# EAGLE schematic Bhoreal Slimpro (EAGLE 7.7.0)

## Sheet 1 of 8
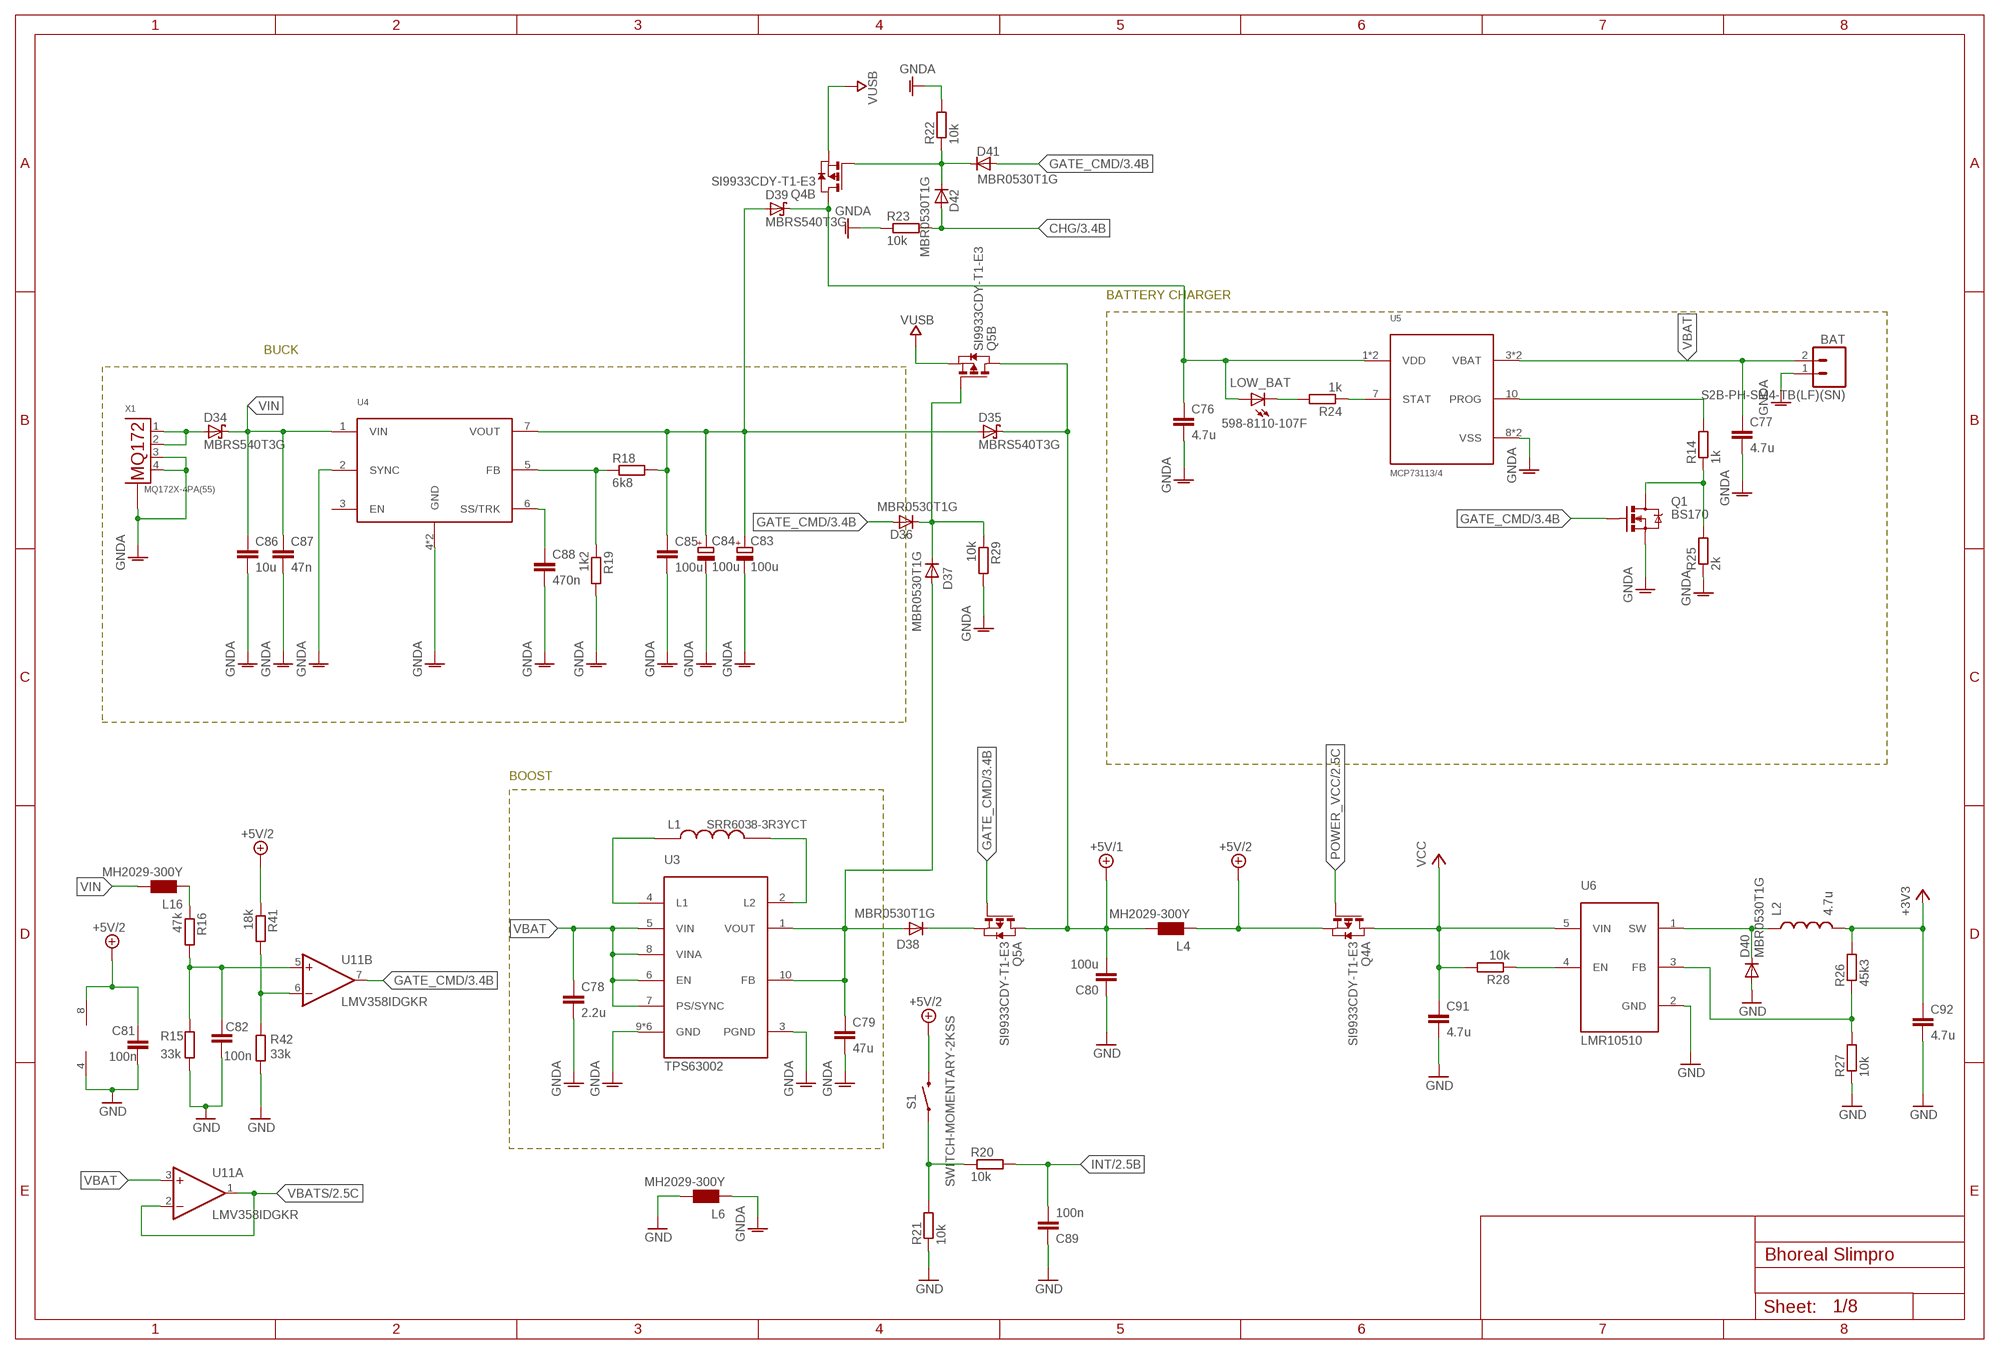
[diagram p0: schematic, sheet 1]

### Parts
BAT  S2B-PH-SM4-TB(LF)(SN)  M02-JST-2MM-SMT  [S2B-PH]
C76  4.7u  C-EUC0805  [C0805]
C77  4.7u  C-EUC0805  [C0805]
C78  2.2u  C-EUC0805  [C0805]
C79  47u  C-EUC1812  [C1812]
C80  100u  C-EUC1206  [C1206]
C81  100n  C-EUC0603  [C0603]
C82  100n  C-EUC0603  [C0603]
C83  100u  CPOL-EUD/7343-31R  [D/7343-31R]
C84  100u  CPOL-EUD/7343-31R  [D/7343-31R]
C85  100u  C-EUC1210  [C1210]
C86  10u  C-EUC1210  [C1210]
C87  47n  C-EUC1206  [C1206]
C88  470n  C-EUC0805  [C0805]
C89  100n  C-EUC0603  [C0603]
C91  4.7u  C-EUC0603  [C0603]
C92  4.7u  C-EUC0603  [C0603]
D34  MBRS540T3G  SCHOTTKY-DIODESMC  [SMC]
D35  MBRS540T3G  SCHOTTKY-DIODESMC  [SMC]
D36  MBR0530T1G  DIODE-SOD123  [SOD123]
D37  MBR0530T1G  DIODE-SOD123  [SOD123]
D38  MBR0530T1G  DIODE-SOD123  [SOD123]
D39  MBRS540T3G  SCHOTTKY-DIODESMC  [SMC]
D40  MBR0530T1G  DIODE-SOD123  [SOD123]
D41  MBR0530T1G  DIODE-SOD123  [SOD123]
D42  MBR0530T1G  DIODE-SOD123  [SOD123]
L1  SRR6038-3R3YCT  LSRR6038  [SRR6038]
L2  4.7u  INDUCTOR1210  [1210]
L4  MH2029-300Y  WE-CBF_0805  [0805]
L6  MH2029-300Y  WE-CBF_0805  [0805]
L16  MH2029-300Y  WE-CBF_0805  [0805]
LOW_BAT  598-8110-107F  LEDCHIP-LED0805  [CHIP-LED0805]
Q1  BS170  MOSFET-NCHANNELBSS123LT1G  [SOT23]
Q4  SI9933CDY-T1-E3  PMOS2SO8  [SO8]
Q5  SI9933CDY-T1-E3  PMOS2SO8  [SO8]
R14  1k  R-EU_R0603  [R0603]
R15  33k  R-EU_R0603  [R0603]
R16  47k  R-EU_R0603  [R0603]
R18  6k8  R-EU_R0603  [R0603]
R19  1k2  R-EU_R0603  [R0603]
R20  10k  R-EU_R0603  [R0603]
R21  10k  R-EU_R0603  [R0603]
R22  10k  R-EU_R0603  [R0603]
R23  10k  R-EU_R0603  [R0603]
R24  1k  R-EU_R0603  [R0603]
R25  2k  R-EU_R0603  [R0603]
R26  45k3  R-EU_R0603  [R0603]
R27  10k  R-EU_R0603  [R0603]
R28  10k  R-EU_R0603  [R0603]
R29  10k  R-EU_R0603  [R0603]
R41  18k  R-EU_R0603  [R0603]
R42  33k  R-EU_R0603  [R0603]
S1  SWITCH-MOMENTARY-2KSS  [KSS241G]
U3  TPS63002  [QFN-10_PAD]
U4  LMZ2200X  [TO-PMOD]
U5  MCP73113/4  [DFN-10]
U6  LMR10510  LMR10510SOT23  [SOT23-5L]
U11  LMV358IDGKR  LMV358MMX  [MSOP08]
X1  MQ172X-4PA(55)  [MQ172X-4PA(55)]

### Nets
+3V3: C92.1 L2.2 R26.2 ; also sheet 3,4
+5V/1 [power]: C80.2 D35.C L4.2 Q5.5(B:D) Q5.6(B:D) Q5.7(A:D) Q5.8(A:D) ; also sheet 4
+5V/2: C81.1 L4.1 Q4.1(A:S) R41.1 S1.2 U11.8(P:V+) ; also sheet 2,3
CHG: D42.A R23.2 ; also sheet 3
CMP: C82.2 R15.1 R16.2 U11.5(B:+IN)
GATE_CMD: D36.A D41.A Q1.1(G) Q5.2(A:G) U11.7(B:OUT) ; also sheet 3
GND: C80.1 C81.2 C82.1 C89.1 C91.2 C92.2 D40.A L6.2 R15.2 R21.1 R27.1 R42.2 U6.2(GND) U11.4(P:V-) ; also sheet 2,3,4
GNDA [power]: BAT.1 C76.2 C77.2 C78.2 C79.2 C83.- C84.- C85.2 C86.2 C87.2 C88.2 L6.1 Q1.2(S) R19.2 R22.2 R23.1 R25.1 R29.2 U3.3(PGND) U3.9(GND) U3.11(GND) U3.12(GND) U3.13(GND) U3.14(GND) U3.15(GND) U4.2(SYNC) U4.4(GND) U4.8(GND) U5.8(VSS) U5.9(VSS) X1.3 X1.4 X1.P$1 X1.P$2 ; also sheet 2,5,6,7,8
INT: C89.2 R20.2 ; also sheet 2,3
N$61: R41.2 R42.1 U11.6(B:-IN)
N$120: D41.C D42.C Q4.4(B:G) R22.1
N$121: R14.2 U5.10(PROG)
N$122: L1.P$1 U3.4(L1)
N$123: L1.P$2 U3.2(L2)
N$124: D34.A X1.1 X1.2
N$125 [power]: C79.1 D37.A D38.A U3.1(VOUT) U3.10(FB)
N$126 [power]: C76.1 D39.C LOW_BAT.A Q4.5(B:D) Q4.6(B:D) U5.1(VDD) U5.2(VDD)
N$127: C83.+ C84.+ C85.1 D35.A D39.A R18.2 U4.7(VOUT)
N$129: R18.1 R19.1 U4.5(FB)
N$130: C88.1 U4.6(SS/TRK)
N$131: R20.1 R21.2 S1.1
N$132: D36.C D37.C Q5.4(B:G) R29.1
N$133: LOW_BAT.C R24.2
N$134: R24.1 U5.7(STAT)
N$135: Q1.3(D) R14.1 R25.2
N$136: D40.C L2.1 U6.1(SW)
N$137: R28.1 U6.4(EN)
N$138: R26.1 R27.2 U6.3(FB)
N$139: D38.C Q5.1(A:S)
N$146: L16.1 R16.1
POWER_VCC: Q4.2(A:G) ; also sheet 2
VBAT [power]: BAT.2 C77.1 C78.1 U3.5(VIN) U3.6(EN) U3.7(PS/SYNC) U3.8(VINA) U5.3(VBAT) U5.4(VBAT) U11.3(A:+IN)
VBATS: U11.1(A:OUT) U11.2(A:-IN) ; also sheet 2,3
VCC: C91.1 Q4.7(A:D) Q4.8(A:D) R28.2 U6.5(VIN) ; also sheet 4,5,6,7,8
VIN: C86.1 C87.1 D34.C L16.2 U4.1(VIN)
VUSB [power]: Q4.3(B:S) Q5.3(B:S) ; also sheet 2,3
Unconnected: U4.3(EN)

### Notes on the sheet
- BATTERY CHARGER
- BUCK
- BOOST

## Sheet 2 of 8
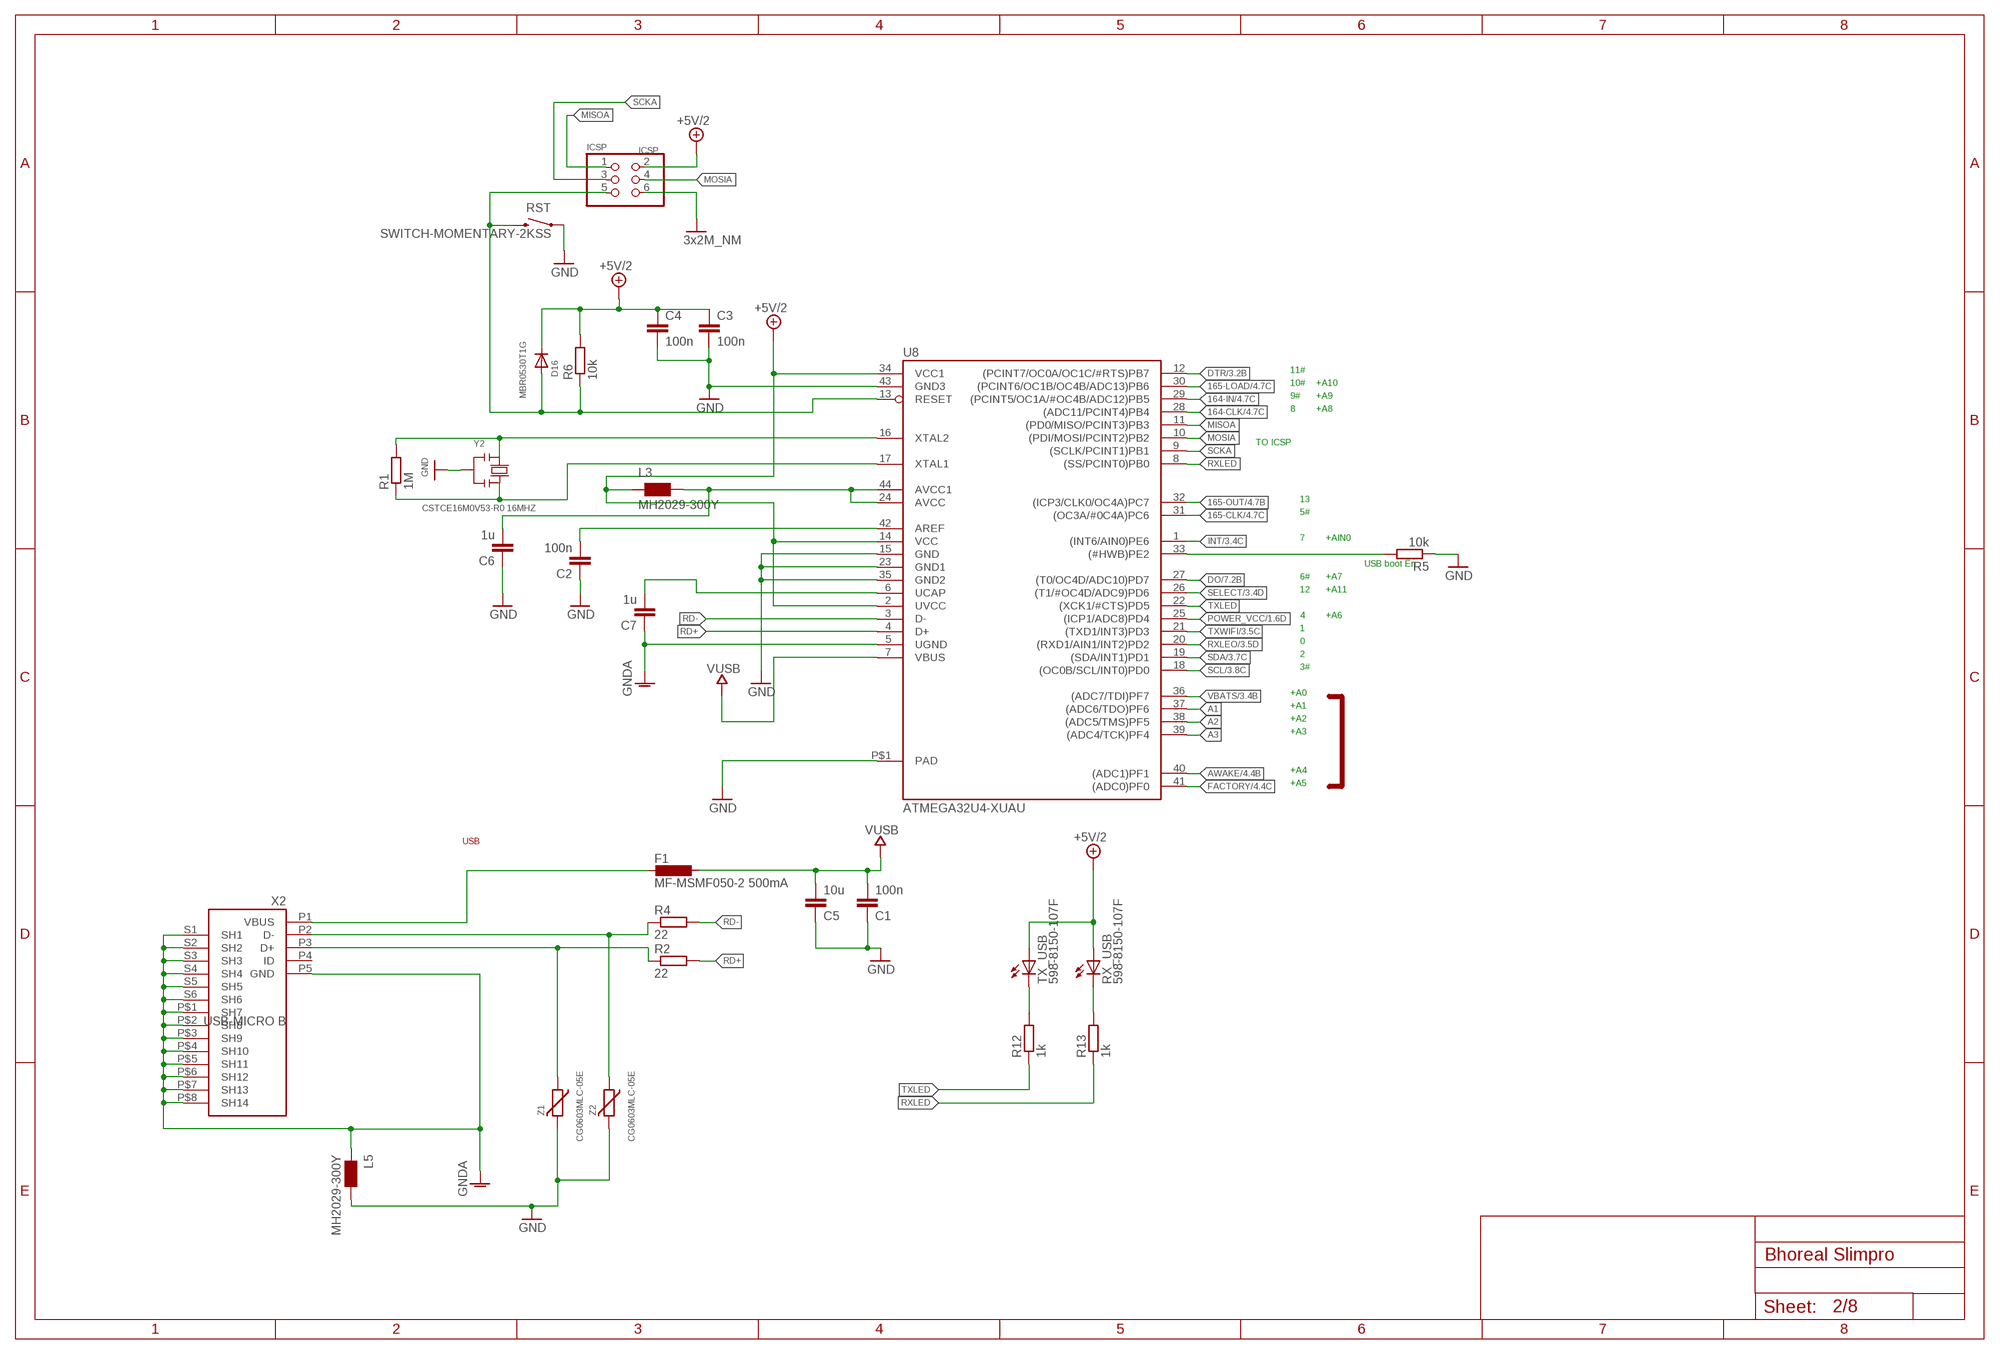
[diagram p1: schematic, sheet 2]

### Parts
C1  100n  C-EUC0603  [C0603]
C2  100n  C-EUC0603  [C0603]
C3  100n  C-EUC0603  [C0603]
C4  100n  C-EUC0603  [C0603]
C5  10u  C-EUC0805  [C0805]
C6  1u  C-EUC0805  [C0805]
C7  1u  C-EUC0805  [C0805]
D16  MBR0530T1G  DIODE-SOD123  [SOD123]
F1  MF-MSMF050-2 500mA  L-EUL1812  [L1812]
ICSP  ICSP  PINHD-2X3  [2X03]
L3  MH2029-300Y  WE-CBF_0805  [0805]
L5  MH2029-300Y  WE-CBF_0805  [0805]
R1  1M  R-EU_R0603  [R0603]
R2  22  R-EU_R0603  [R0603]
R4  22  R-EU_R0603  [R0603]
R5  10k  R-EU_R0603  [R0603]
R6  10k  R-EU_R0603  [R0603]
R12  1k  R-EU_R0603  [R0603]
R13  1k  R-EU_R0603  [R0603]
RST  SWITCH-MOMENTARY-2KSS  [KSS241G]
RX_USB  598-8150-107F  LEDCHIPLED_0805  [CHIPLED_0805]
TX_USB  598-8150-107F  LEDCHIPLED_0805  [CHIPLED_0805]
U8  ATMEGA32U4-XUAU  [TQFP44-PAD]
X2  USB-MICRO B  MYCON2_USB-MINI-B  [CON2_USB_MICRO_B_AT]
Y2  CSTCE16M0V53-R0 16MHZ  RESONATORMU  [RESONATOR]
Z1  CG0603MLC-05E  VARISTORCN0603  [CT/CN0603]
Z2  CG0603MLC-05E  VARISTORCN0603  [CT/CN0603]

### Nets
164-CLK: U8.28((ADC11/PCINT4)PB4) ; also sheet 4
164-IN: U8.29((PCINT5/OC1A/#OC4B/ADC12)PB5) ; also sheet 4
165-CLK: U8.31((OC3A/#0C4A)PC6) ; also sheet 4
165-LOAD: U8.30((PCINT6/OC1B/OC4B/ADC13)PB6) ; also sheet 4
165-OUT: U8.32((ICP3/CLK0/OC4A)PC7) ; also sheet 4
+5V/2: C3.1 C4.1 D16.C ICSP.2 L3.1 R6.2 RX_USB.A TX_USB.A U8.2(UVCC) U8.14(VCC) U8.34(VCC1) ; also sheet 1,3
A1: U8.37((ADC6/TDO)PF6)
A2: U8.38((ADC5/TMS)PF5)
A3: U8.39((ADC4/TCK)PF4)
AREF: C2.2 U8.42(AREF)
AVCC: C6.2 L3.2 U8.24(AVCC) U8.44(AVCC1)
AWAKE: U8.40((ADC1)PF1) ; also sheet 4
D+: R2.1 X2.P3(D+) Z1.1
D-: R4.1 X2.P2(D-) Z2.1
DO: U8.27((T0/OC4D/ADC10)PD7) ; also sheet 7
DTR: U8.12((PCINT7/OC0A/OC1C/#RTS)PB7) ; also sheet 3
FACTORY: U8.41((ADC0)PF0) ; also sheet 4
GND: C1.1 C2.1 C3.2 C4.2 C5.1 C6.1 ICSP.6 L5.2 R5.1 RST.1 U8.15(GND) U8.23(GND1) U8.35(GND2) U8.43(GND3) U8.P$1(PAD) Y2.2 Z1.2 Z2.2 ; supply symbol labelled 3x2M_NM ; also sheet 1,3,4
GNDA [power]: C7.1 L5.1 U8.5(UGND) X2.P5(GND) X2.P$1(SH7) X2.P$2(SH8) X2.P$3(SH9) X2.P$4(SH10) X2.P$5(SH11) X2.P$6(SH12) X2.P$7(SH13) X2.P$8(SH14) X2.S1(SH1) X2.S2(SH2) X2.S3(SH3) X2.S4(SH4) X2.S5(SH5) X2.S6(SH6) ; also sheet 1,5,6,7,8
HWB: R5.2 U8.33((#HWB)PE2)
INT: U8.1((INT6/AIN0)PE6) ; also sheet 1,3
MISOA: ICSP.1 U8.11((PD0/MISO/PCINT3)PB3)
MOSIA: ICSP.4 U8.10((PDI/MOSI/PCINT2)PB2)
N$2 [usbvcc]: R12.2 TX_USB.C
N$4 [usbvcc]: R13.2 RX_USB.C
POWER_VCC: U8.25((ICP1/ADC8)PD4) ; also sheet 1
RD+: R2.2 U8.4(D+)
RD-: R4.2 U8.3(D-)
RST: D16.A ICSP.5 R6.1 RST.2 U8.13(RESET) ; also sheet 4
RXLED: R13.1 U8.8((SS/PCINT0)PB0)
RXLEO: U8.20((RXD1/AIN1/INT2)PD2) ; also sheet 3
SCKA: ICSP.3 U8.9((SCLK/PCINT1)PB1)
SCL: U8.18((OC0B/SCL/INT0)PD0) ; also sheet 3
SDA: U8.19((SDA/INT1)PD1) ; also sheet 3
SELECT: U8.26((T1/#OC4D/ADC9)PD6) ; also sheet 3
TXLED: R12.1 U8.22((XCK1/#CTS)PD5)
TXWIFI: U8.21((TXD1/INT3)PD3) ; also sheet 3,4
UCAP: C7.2 U8.6(UCAP)
VBATS: U8.36((ADC7/TDI)PF7) ; also sheet 1,3
VUSB [power]: C1.2 C5.2 F1.1 U8.7(VBUS) ; also sheet 1,3
XTAL3: R1.2 U8.16(XTAL2) Y2.1
XTAL4: R1.1 U8.17(XTAL1) Y2.3
XUSB [power]: F1.2 X2.P1(VBUS)
Unconnected: X2.P4(ID)

### Notes on the sheet
- 11#
- 10# | +A10
- 9# | +A9
- 8 | +A8
- TO ICSP
- 13
- 5#
- 7 | +AIN0
- USB boot En
- 6# | +A7
- 12 | +A11
- 4 | +A6
- 1
- 0
- 2
- 3#
- +A0
- +A1
- +A2
- +A3
- +A4
- +A5
- USB

## Sheet 3 of 8
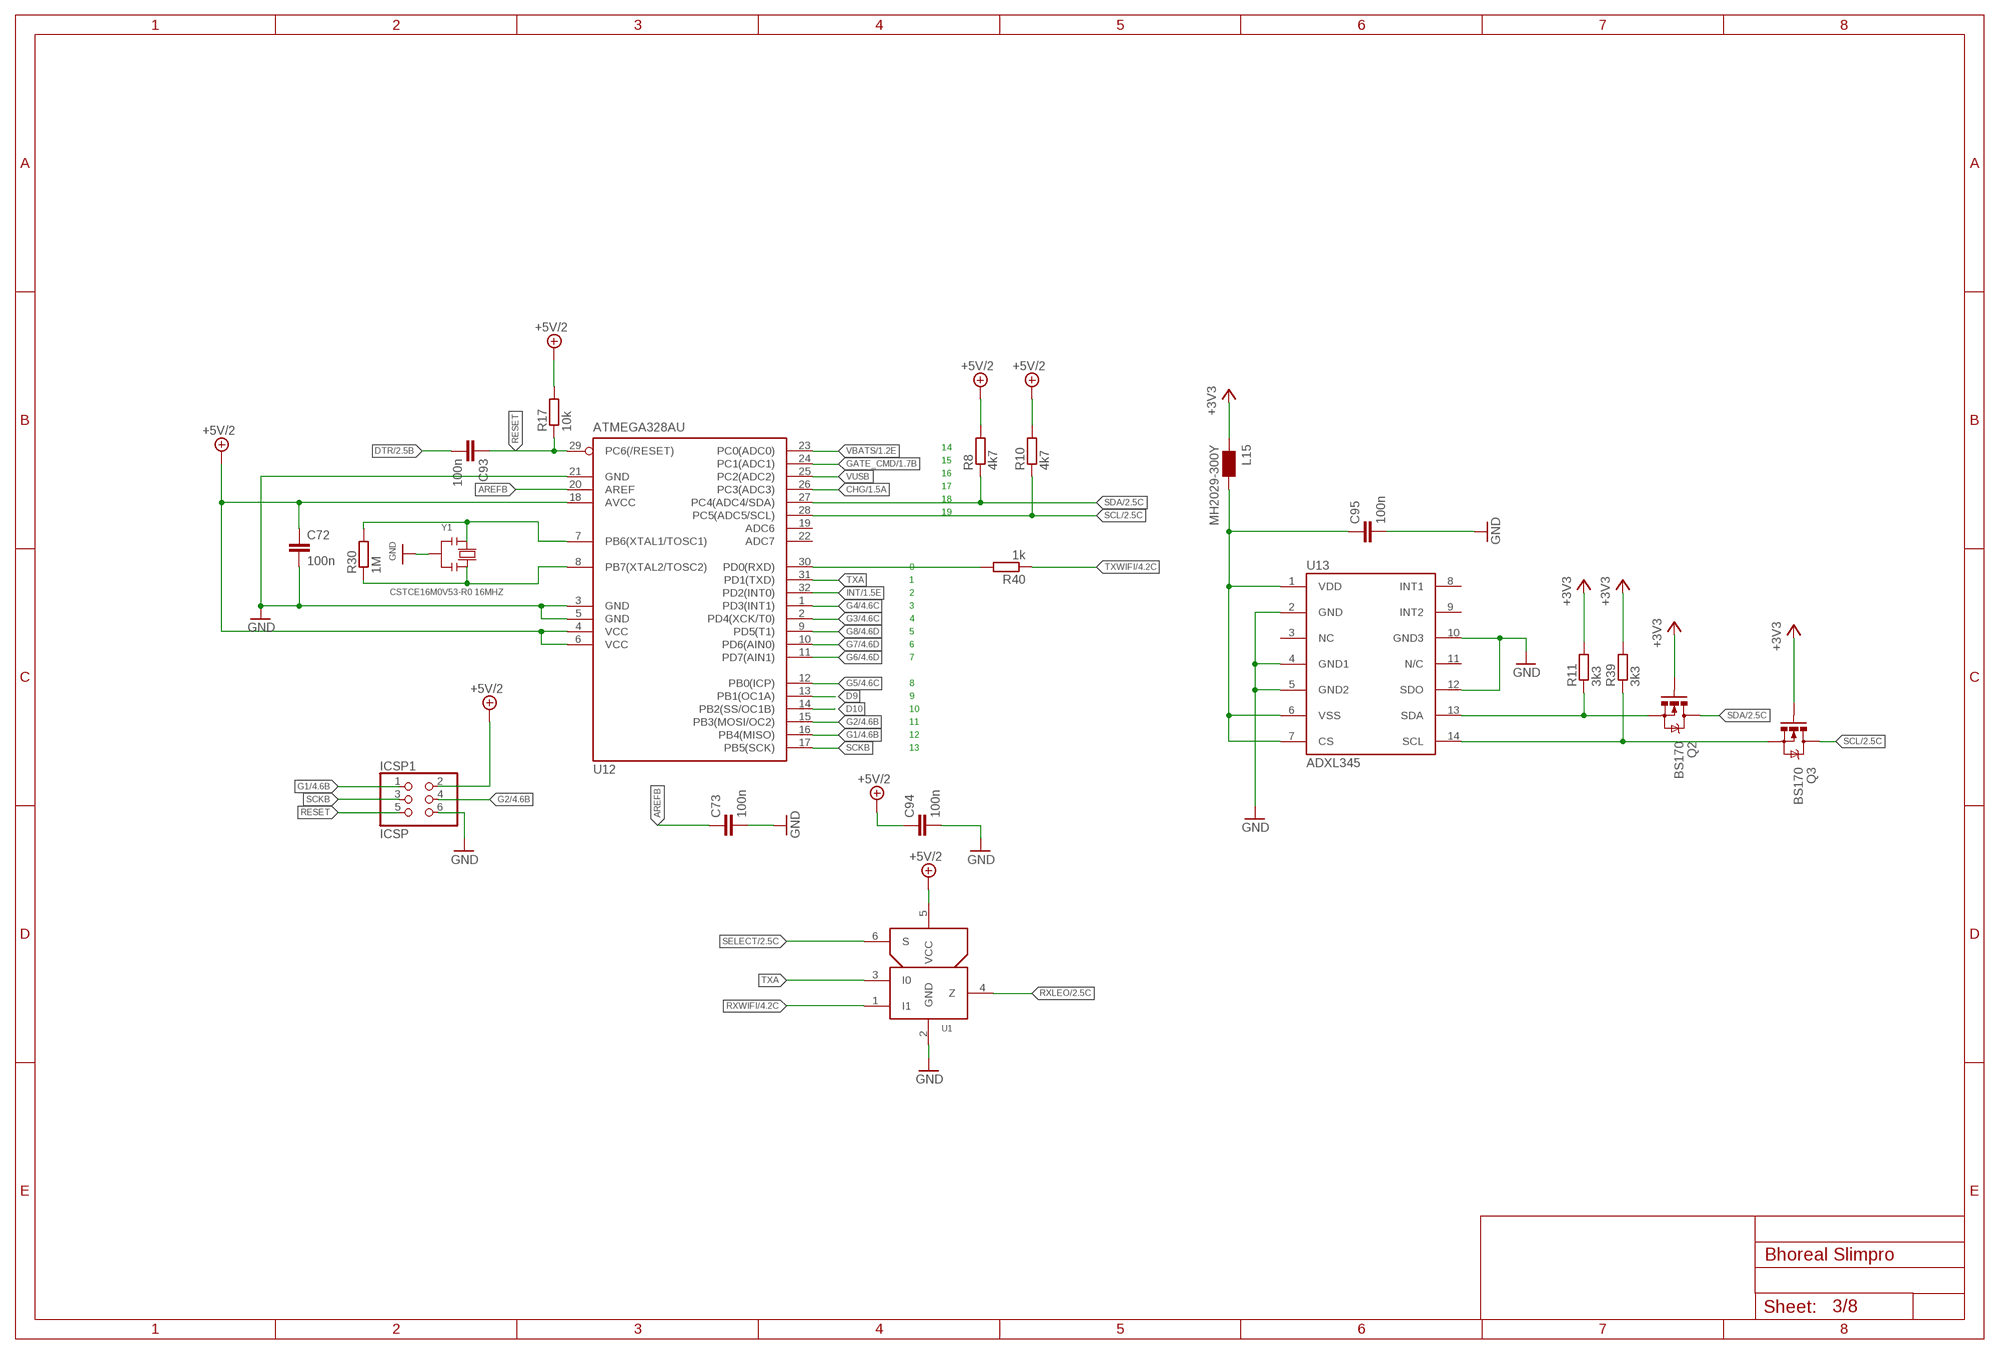
[diagram p2: schematic, sheet 3]

### Parts
C72  100n  C-EUC0603  [C0603]
C73  100n  C-EUC0603  [C0603]
C93  100n  C-EUC0603  [C0603]
C94  100n  C-EUC0603  [C0603]
C95  100n  C-EUC0603  [C0603]
ICSP1  ICSP  PINHD-2X3  [2X03]
L15  MH2029-300Y  WE-CBF_0805  [0805]
Q2  BS170  MOSFET-NCHANNELBSS123LT1G  [SOT23]
Q3  BS170  MOSFET-NCHANNELBSS123LT1G  [SOT23]
R8  4k7  R-EU_R0603  [R0603]
R10  4k7  R-EU_R0603  [R0603]
R11  3k3  R-EU_R0603  [R0603]
R17  10k  R-EU_R0603  [R0603]
R30  1M  R-EU_R0603  [R0603]
R39  3k3  R-EU_R0603  [R0603]
R40  1k  R-EU_R0603  [R0603]
U1  NC7SZ157P6X  NC7SV157  [SC70]
U12  ATMEGA328AU  MEGA8-AI  [TQFP32-08]
U13  ADXL345  [LGA14]
Y1  CSTCE16M0V53-R0 16MHZ  RESONATORMU  [RESONATOR]

### Nets
+3V3: L15.1 Q2.1(G) Q3.1(G) R11.2 R39.2 ; also sheet 1,4
+5V/2: C72.1 C94.1 ICSP1.2 R8.2 R10.2 R17.2 U1.5(VCC) U12.4(VCC) U12.6(VCC) U12.18(AVCC) ; also sheet 1,2
AREFB: C73.1 U12.20(AREF)
CHG: U12.26(PC3(ADC3)) ; also sheet 1
D9: U12.13(PB1(OC1A))
D10: U12.14(PB2(SS/OC1B))
DTR: C93.2 ; also sheet 2
G1: ICSP1.1 U12.16(PB4(MISO)) ; also sheet 4
G2: ICSP1.4 U12.15(PB3(MOSI/OC2)) ; also sheet 4
G3: U12.2(PD4(XCK/T0)) ; also sheet 4
G4: U12.1(PD3(INT1)) ; also sheet 4
G5: U12.12(PB0(ICP)) ; also sheet 4
G6: U12.11(PD7(AIN1)) ; also sheet 4
G7: U12.10(PD6(AIN0)) ; also sheet 4
G8: U12.9(PD5(T1)) ; also sheet 4
GATE_CMD: U12.24(PC1(ADC1)) ; also sheet 1
GND: C72.2 C73.2 C94.2 C95.2 ICSP1.6 U1.2(GND) U12.3(GND) U12.5(GND) U12.21(GND) U13.2(GND) U13.4(GND1) U13.5(GND2) U13.10(GND3) U13.12(SDO) Y1.2 ; also sheet 1,2,4
INT: U12.32(PD2(INT0)) ; also sheet 1,2
N$128: C95.1 L15.2 U13.1(VDD) U13.6(VSS) U13.7(CS)
N$143: Q2.2(S) R11.1 U13.13(SDA)
N$144: Q3.2(S) R39.1 U13.14(SCL)
RESET: C93.1 ICSP1.5 R17.1 U12.29(PC6(/RESET))
RXA: R40.2 U12.30(PD0(RXD))
RXLEO: U1.4(Z) ; also sheet 2
RXWIFI: U1.1(I1) ; also sheet 4
SCKB: ICSP1.3 U12.17(PB5(SCK))
SCL: Q3.3(D) R10.1 U12.28(PC5(ADC5/SCL)) ; also sheet 2
SDA: Q2.3(D) R8.1 U12.27(PC4(ADC4/SDA)) ; also sheet 2
SELECT: U1.6(S) ; also sheet 2
TXA: U1.3(I0) U12.31(PD1(TXD))
TXWIFI: R40.1 ; also sheet 2,4
VBATS: U12.23(PC0(ADC0)) ; also sheet 1,2
VUSB [power]: U12.25(PC2(ADC2)) ; also sheet 1,2
XTAL1: R30.2 U12.7(PB6(XTAL1/TOSC1)) Y1.1
XTAL2: R30.1 U12.8(PB7(XTAL2/TOSC2)) Y1.3
Unconnected: U12.19(ADC6) U12.22(ADC7) U13.3(NC) U13.8(INT1) U13.9(INT2) U13.11(N/C)

### Notes on the sheet
- 14
- 15
- 16
- 17
- 18
- 19
- 0
- 1
- 2
- 3
- 4
- 5
- 6
- 7
- 8
- 9
- 10
- 11
- 12
- 13

## Sheet 4 of 8
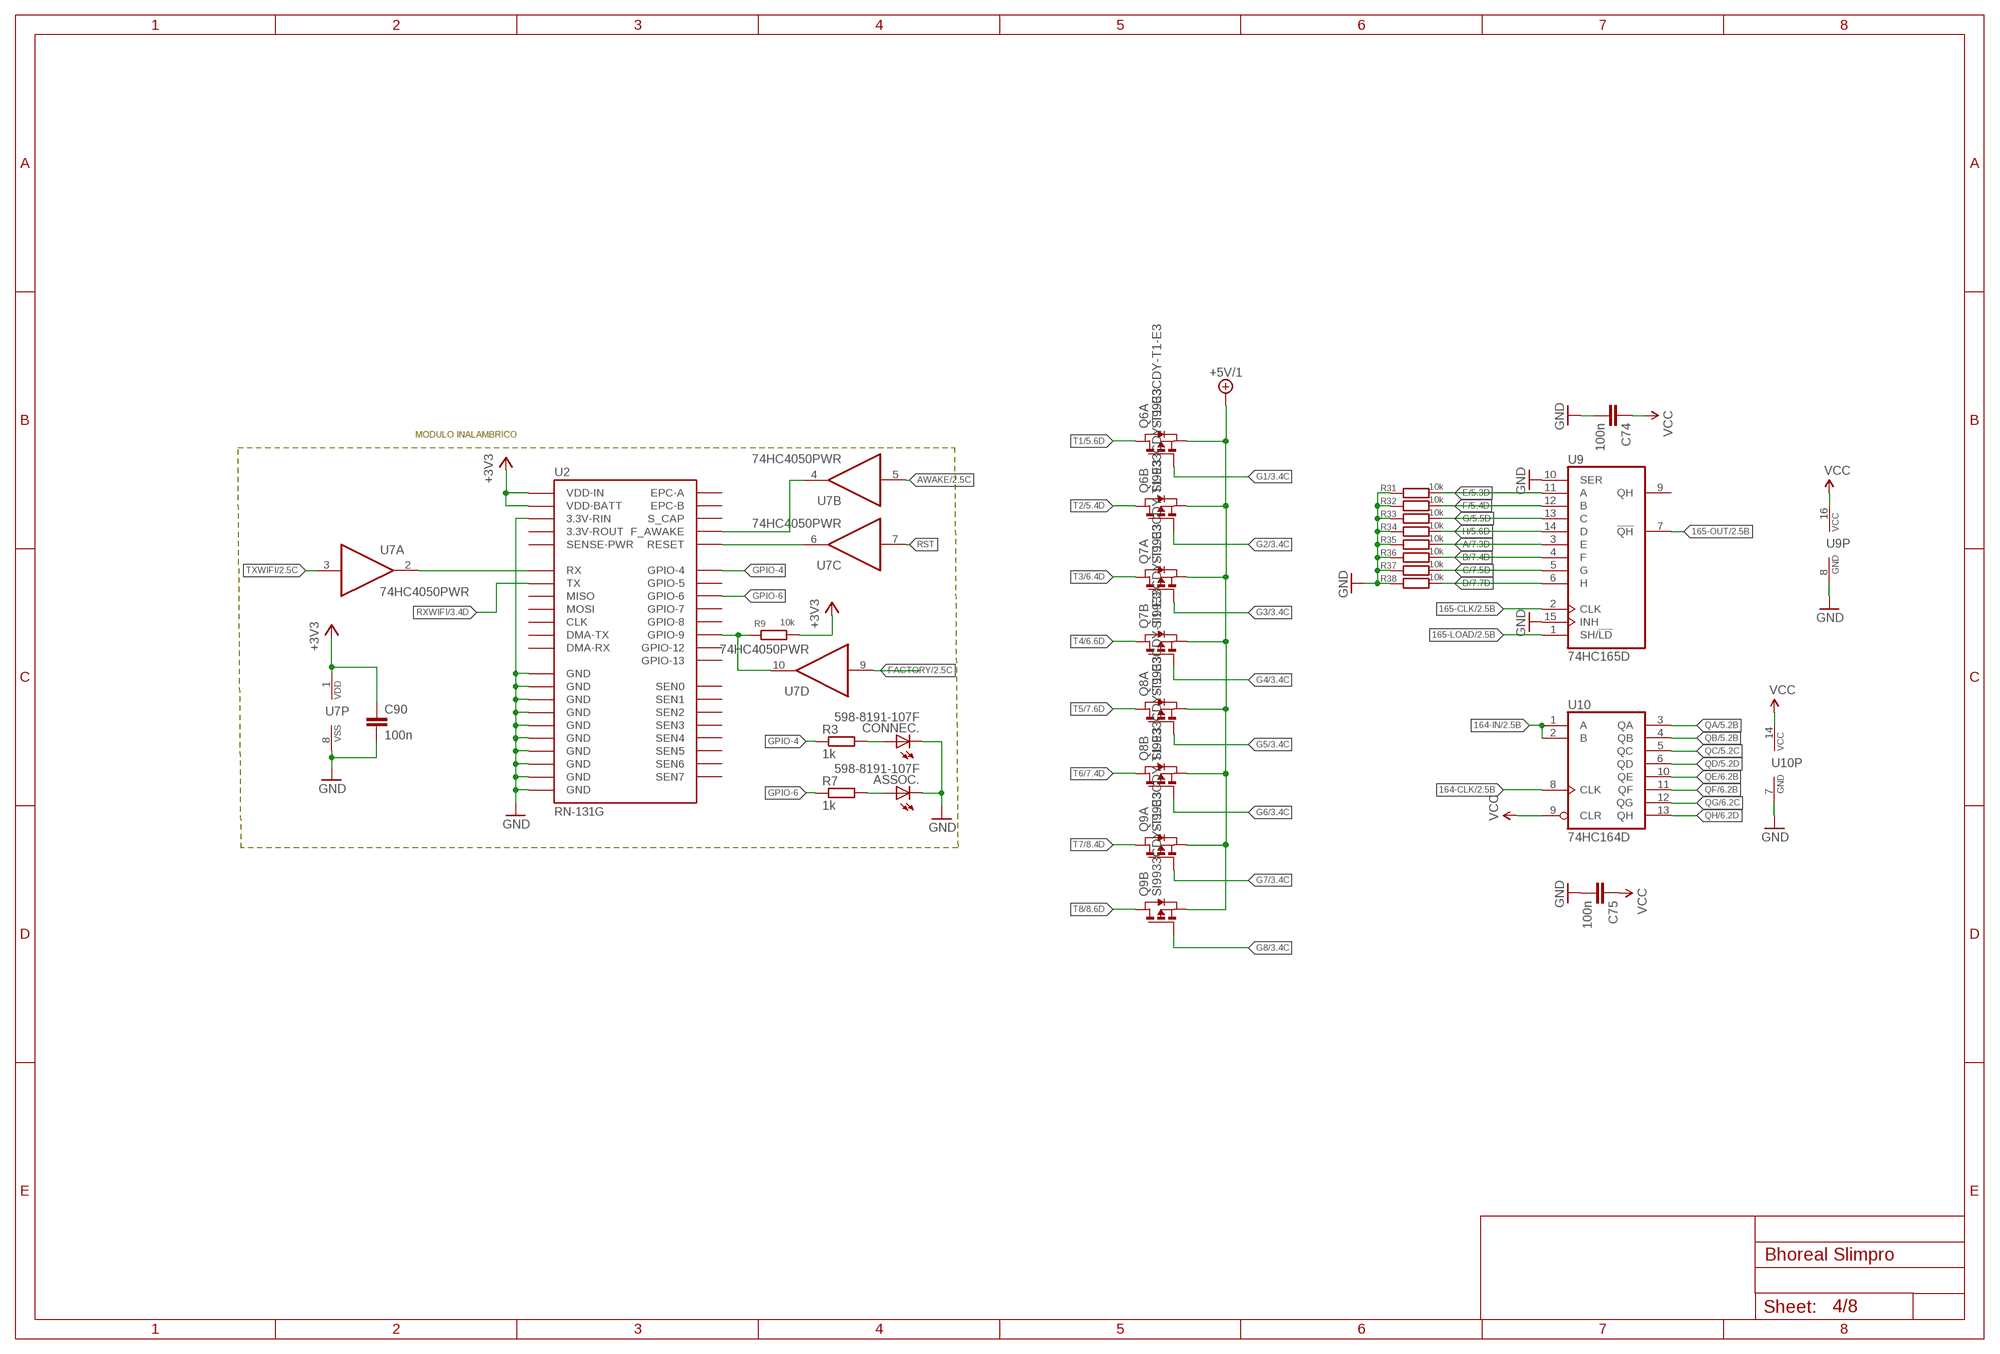
[diagram p3: schematic, sheet 4]

### Parts
ASSOC.  598-8191-107F  LEDCHIP-LED0805  [CHIP-LED0805]
C74  100n  C-EUC0603  [C0603]
C75  100n  C-EUC0603  [C0603]
C90  100n  C-EUC0603  [C0603]
CONNEC.  598-8191-107F  LEDCHIP-LED0805  [CHIP-LED0805]
Q6  SI9933CDY-T1-E3  PMOS2SO8  [SO8]
Q7  SI9933CDY-T1-E3  PMOS2SO8  [SO8]
Q8  SI9933CDY-T1-E3  PMOS2SO8  [SO8]
Q9  SI9933CDY-T1-E3  PMOS2SO8  [SO8]
R3  1k  R-EU_R0603  [R0603]
R7  1k  R-EU_R0603  [R0603]
R9  10k  R-EU_R0603  [R0603]
R31  10k  R-EU_R0603  [R0603]
R32  10k  R-EU_R0603  [R0603]
R33  10k  R-EU_R0603  [R0603]
R34  10k  R-EU_R0603  [R0603]
R35  10k  R-EU_R0603  [R0603]
R36  10k  R-EU_R0603  [R0603]
R37  10k  R-EU_R0603  [R0603]
R38  10k  R-EU_R0603  [R0603]
U2  RN-131G  [RN-131G]
U7  74HC4050PWR  [TSSOP16]
U9  74HC165D  [SO16]
U10  74HC164D  [SO14]

### Nets
164-CLK: U10.8(CLK) ; also sheet 2
164-IN: U10.1(A) U10.2(B) ; also sheet 2
165-CLK: U9.2(CLK) ; also sheet 2
165-LOAD: U9.1(SH/!LD) ; also sheet 2
165-OUT: U9.7(!QH) ; also sheet 2
+3V3: C90.1 R9.2 U2.P$20(VDD-BATT) U2.P$21(VDD-IN) U7.1(P:VDD) ; also sheet 1,3
+5V/1 [power]: Q6.1(A:S) Q6.3(B:S) Q7.1(A:S) Q7.3(B:S) Q8.1(A:S) Q8.3(B:S) Q9.1(A:S) Q9.3(B:S) ; also sheet 1
A: R35.2 U9.3(E) ; also sheet 7,8
AWAKE: U7.5(B:I) ; also sheet 2
B: R36.2 U9.4(F) ; also sheet 7,8
C: R37.2 U9.5(G) ; also sheet 7,8
D: R38.2 U9.6(H) ; also sheet 7,8
E: R31.2 U9.11(A) ; also sheet 5,6
F: R32.2 U9.12(B) ; also sheet 5,6
FACTORY: U7.9(D:I) ; also sheet 2
G: R33.2 U9.13(C) ; also sheet 5,6
G1: Q6.2(A:G) ; also sheet 3
G2: Q6.4(B:G) ; also sheet 3
G3: Q7.2(A:G) ; also sheet 3
G4: Q7.4(B:G) ; also sheet 3
G5: Q8.2(A:G) ; also sheet 3
G6: Q8.4(B:G) ; also sheet 3
G7: Q9.2(A:G) ; also sheet 3
G8: Q9.4(B:G) ; also sheet 3
GND: ASSOC..C C74.2 C75.2 C90.2 CONNEC..C R31.1 R32.1 R33.1 R34.1 R35.1 R36.1 R37.1 R38.1 U2.P$18(3.3V-RIN) U2.P$19(GND) U2.P$36(GND) U2.P$37(GND) U2.P$38(GND) U2.P$39(GND) U2.P$40(GND) U2.P$41(GND) U2.P$42(GND) U2.P$43(GND) U2.P$44(GND) U7.8(P:VSS) U9.8(GND) U9.10(SER) U9.15(INH) U10.7(GND) ; also sheet 1,2,3
GPIO-4: R3.1 U2.P$29(GPIO-4)
GPIO-6: R7.1 U2.P$27(GPIO-6)
H: R34.2 U9.14(D) ; also sheet 5,6
N$117: CONNEC..A R3.2
N$118: ASSOC..A R7.2
N$119: U2.P$12(RX) U7.2(A:O)
N$140: R9.1 U2.P$24(GPIO-9) U7.10(D:O)
N$141: U2.P$9(F_AWAKE) U7.4(B:O)
N$142: U2.P$5(RESET) U7.6(C:O)
QA: U10.3(QA) ; also sheet 5,7
QB: U10.4(QB) ; also sheet 5,7
QC: U10.5(QC) ; also sheet 5,7
QD: U10.6(QD) ; also sheet 5,7
QE: U10.10(QE) ; also sheet 6,8
QF: U10.11(QF) ; also sheet 6,8
QG: U10.12(QG) ; also sheet 6,8
QH: U10.13(QH) ; also sheet 6,8
RST: U7.7(C:I) ; also sheet 2
RXWIFI: U2.P$13(TX) ; also sheet 3
T1 [power_led]: Q6.7(A:D) Q6.8(A:D) ; also sheet 5
T2 [power_led]: Q6.5(B:D) Q6.6(B:D) ; also sheet 5
T3 [power_led]: Q7.7(A:D) Q7.8(A:D) ; also sheet 6
T4 [power_led]: Q7.5(B:D) Q7.6(B:D) ; also sheet 6
T5 [power_led]: Q8.7(A:D) Q8.8(A:D) ; also sheet 7
T6 [power_led]: Q8.5(B:D) Q8.6(B:D) ; also sheet 7
T7 [power_led]: Q9.7(A:D) Q9.8(A:D) ; also sheet 8
T8 [power_led]: Q9.5(B:D) Q9.6(B:D) ; also sheet 8
TXWIFI: U7.3(A:I) ; also sheet 2,3
VCC: C74.1 C75.1 U9.16(VCC) U10.9(CLR) U10.14(VCC) ; also sheet 1,5,6,7,8
Unconnected: U2.P$1(SEN6) U2.P$2(SEN4) U2.P$3(SEN5) U2.P$4(SEN7) U2.P$6(EPC-A) U2.P$7(EPC-B) U2.P$8(S_CAP) U2.P$10(GPIO-13) U2.P$11(GPIO-12) U2.P$14(MOSI) U2.P$15(CLK) U2.P$16(MISO) U2.P$17(3.3V-ROUT) U2.P$22(DMA-TX) U2.P$23(DMA-RX) U2.P$25(GPIO-8) U2.P$26(GPIO-7) U2.P$28(GPIO-5) U2.P$30(SEN1) U2.P$31(SEN2) U2.P$32(SEN3) U2.P$33(SENSE-PWR) U2.P$34(SEN0) U7.11(E:I) U7.12(E:O) U7.14(F:I) U7.15(F:O) U9.9(QH)

### Notes on the sheet
- MODULO INALAMBRICO

## Sheet 5 of 8
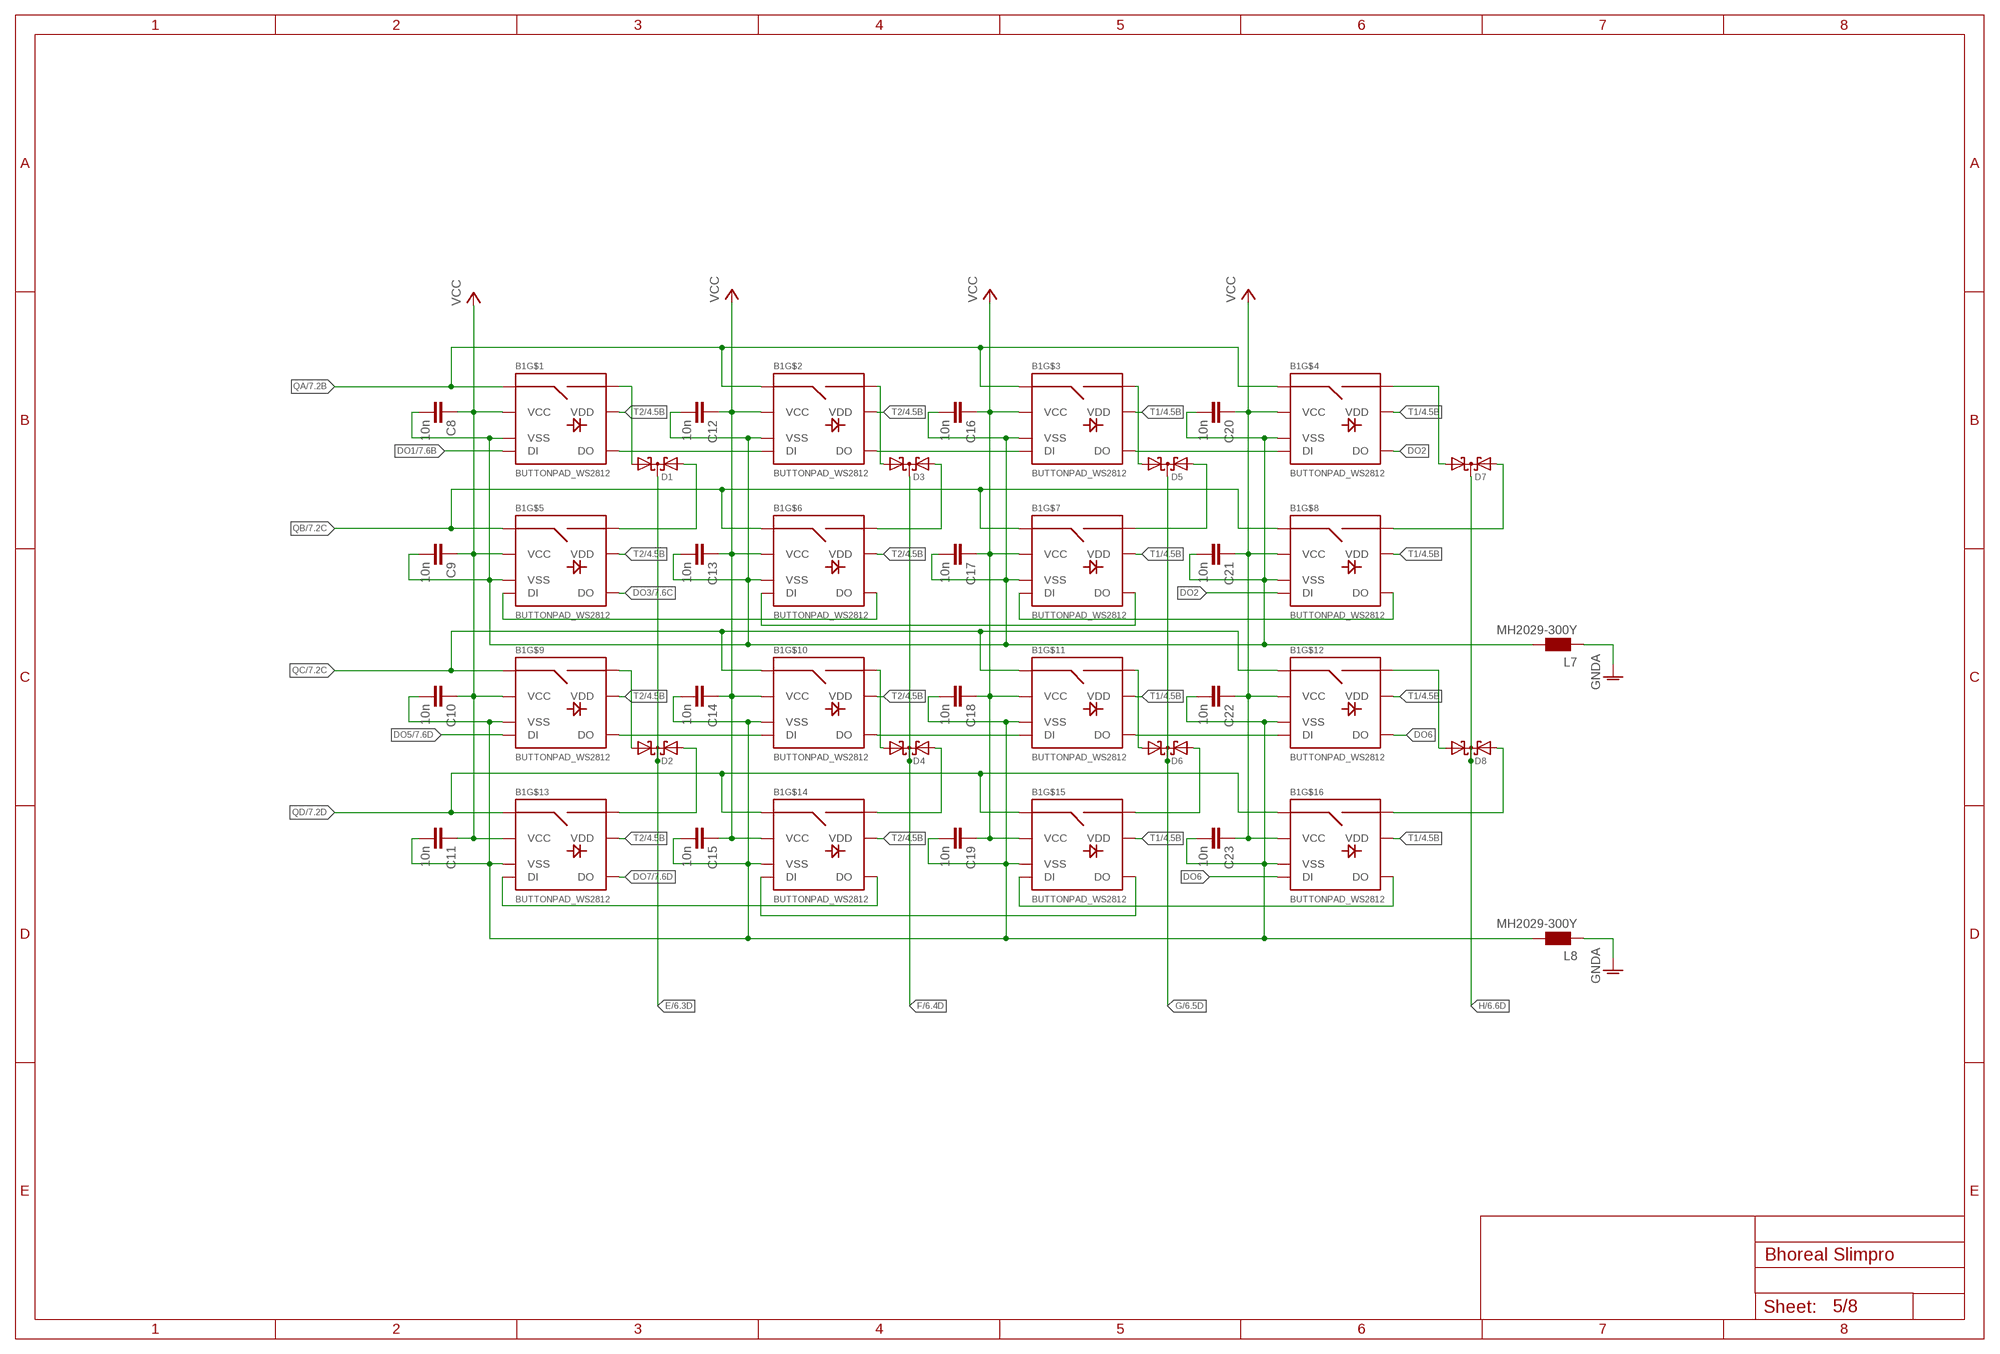
[diagram p4: schematic, sheet 5]

### Parts
B1  BUTTONPAD_WS2812  [BUTTONPAD_WS2812]
C8  10n  C-EUC0603  [C0603]
C9  10n  C-EUC0603  [C0603]
C10  10n  C-EUC0603  [C0603]
C11  10n  C-EUC0603  [C0603]
C12  10n  C-EUC0603  [C0603]
C13  10n  C-EUC0603  [C0603]
C14  10n  C-EUC0603  [C0603]
C15  10n  C-EUC0603  [C0603]
C16  10n  C-EUC0603  [C0603]
C17  10n  C-EUC0603  [C0603]
C18  10n  C-EUC0603  [C0603]
C19  10n  C-EUC0603  [C0603]
C20  10n  C-EUC0603  [C0603]
C21  10n  C-EUC0603  [C0603]
C22  10n  C-EUC0603  [C0603]
C23  10n  C-EUC0603  [C0603]
D1  BAV70LT3G  BAS70-05  [SOT23]
D2  BAV70LT3G  BAS70-05  [SOT23]
D3  BAV70LT3G  BAS70-05  [SOT23]
D4  BAV70LT3G  BAS70-05  [SOT23]
D5  BAV70LT3G  BAS70-05  [SOT23]
D6  BAV70LT3G  BAS70-05  [SOT23]
D7  BAV70LT3G  BAS70-05  [SOT23]
D8  BAV70LT3G  BAS70-05  [SOT23]
L7  MH2029-300Y  WE-CBF_0805  [0805]
L8  MH2029-300Y  WE-CBF_0805  [0805]

### Nets
DO1: B1.2A(DI) ; also sheet 7
DO2: B1.1D(DO) B1.2H(DI)
DO3: B1.1E(DO) ; also sheet 7
DO5: B1.2I(DI) ; also sheet 7
DO6: B1.1L(DO) B1.2P(DI)
DO7: B1.1M(DO) ; also sheet 7
E: D1.3(C) D2.3(C) ; also sheet 4,6
F: D3.3(C) D4.3(C) ; also sheet 4,6
G: D5.3(C) D6.3(C) ; also sheet 4,6
GNDA [power]: L7.1 L8.1 ; also sheet 1,2,6,7,8
H: D7.3(C) D8.3(C) ; also sheet 4,6
N$1: B1.SIG2A(SIG2) D1.1(A1)
N$3: B1.SIG2E(SIG2) D1.2(A2)
N$5: B1.SIG2I(SIG2) D2.1(A1)
N$6: B1.SIG2M(SIG2) D2.2(A2)
N$7: B1.SIG2B(SIG2) D3.1(A1)
N$8: B1.SIG2F(SIG2) D3.2(A2)
N$9: B1.SIG2J(SIG2) D4.1(A1)
N$10: B1.SIG2N(SIG2) D4.2(A2)
N$11: B1.SIG2C(SIG2) D5.1(A1)
N$12: B1.SIG2G(SIG2) D5.2(A2)
N$13: B1.SIG2K(SIG2) D6.1(A1)
N$14: B1.SIG2O(SIG2) D6.2(A2)
N$15: B1.SIG2L(SIG2) D8.1(A1)
N$16: B1.SIG2P(SIG2) D8.2(A2)
N$17: B1.SIG2D(SIG2) D7.1(A1)
N$18: B1.SIG2H(SIG2) D7.2(A2)
N$19: B1.1A(DO) B1.2B(DI)
N$20: B1.1F(DO) B1.2E(DI)
N$21: B1.1G(DO) B1.2F(DI)
N$22: B1.1B(DO) B1.2C(DI)
N$23: B1.1C(DO) B1.2D(DI)
N$24: B1.1H(DO) B1.2G(DI)
N$25: B1.1K(DO) B1.2L(DI)
N$26: B1.1J(DO) B1.2K(DI)
N$27: B1.1I(DO) B1.2J(DI)
N$28: B1.1P(DO) B1.2O(DI)
N$29: B1.1O(DO) B1.2N(DI)
N$30: B1.1N(DO) B1.2M(DI)
N$147 [power_led]: B1.6A(VSS) B1.6B(VSS) B1.6C(VSS) B1.6D(VSS) B1.6E(VSS) B1.6F(VSS) B1.6G(VSS) B1.6H(VSS) C8.2 C9.2 C12.2 C13.2 C16.2 C17.2 C20.2 C21.2 L7.2
N$152 [power_led]: B1.6I(VSS) B1.6J(VSS) B1.6K(VSS) B1.6L(VSS) B1.6M(VSS) B1.6N(VSS) B1.6O(VSS) B1.6P(VSS) C10.2 C11.2 C14.2 C15.2 C18.2 C19.2 C22.2 C23.2 L8.2
QA: B1.SIG1A(SIG1) B1.SIG1B(SIG1) B1.SIG1C(SIG1) B1.SIG1D(SIG1) ; also sheet 4,7
QB: B1.SIG1E(SIG1) B1.SIG1F(SIG1) B1.SIG1G(SIG1) B1.SIG1H(SIG1) ; also sheet 4,7
QC: B1.SIG1I(SIG1) B1.SIG1J(SIG1) B1.SIG1K(SIG1) B1.SIG1L(SIG1) ; also sheet 4,7
QD: B1.SIG1M(SIG1) B1.SIG1N(SIG1) B1.SIG1O(SIG1) B1.SIG1P(SIG1) ; also sheet 4,7
T1 [power_led]: B1.5C(VDD) B1.5D(VDD) B1.5G(VDD) B1.5H(VDD) B1.5K(VDD) B1.5L(VDD) B1.5O(VDD) B1.5P(VDD) ; also sheet 4
T2 [power_led]: B1.5A(VDD) B1.5B(VDD) B1.5E(VDD) B1.5F(VDD) B1.5I(VDD) B1.5J(VDD) B1.5M(VDD) B1.5N(VDD) ; also sheet 4
VCC: B1.3A(VCC) B1.3B(VCC) B1.3C(VCC) B1.3D(VCC) B1.3E(VCC) B1.3F(VCC) B1.3G(VCC) B1.3H(VCC) B1.3I(VCC) B1.3J(VCC) B1.3K(VCC) B1.3L(VCC) B1.3M(VCC) B1.3N(VCC) B1.3O(VCC) B1.3P(VCC) C8.1 C9.1 C10.1 C11.1 C12.1 C13.1 C14.1 C15.1 C16.1 C17.1 C18.1 C19.1 C20.1 C21.1 C22.1 C23.1 ; also sheet 1,4,6,7,8

## Sheet 6 of 8
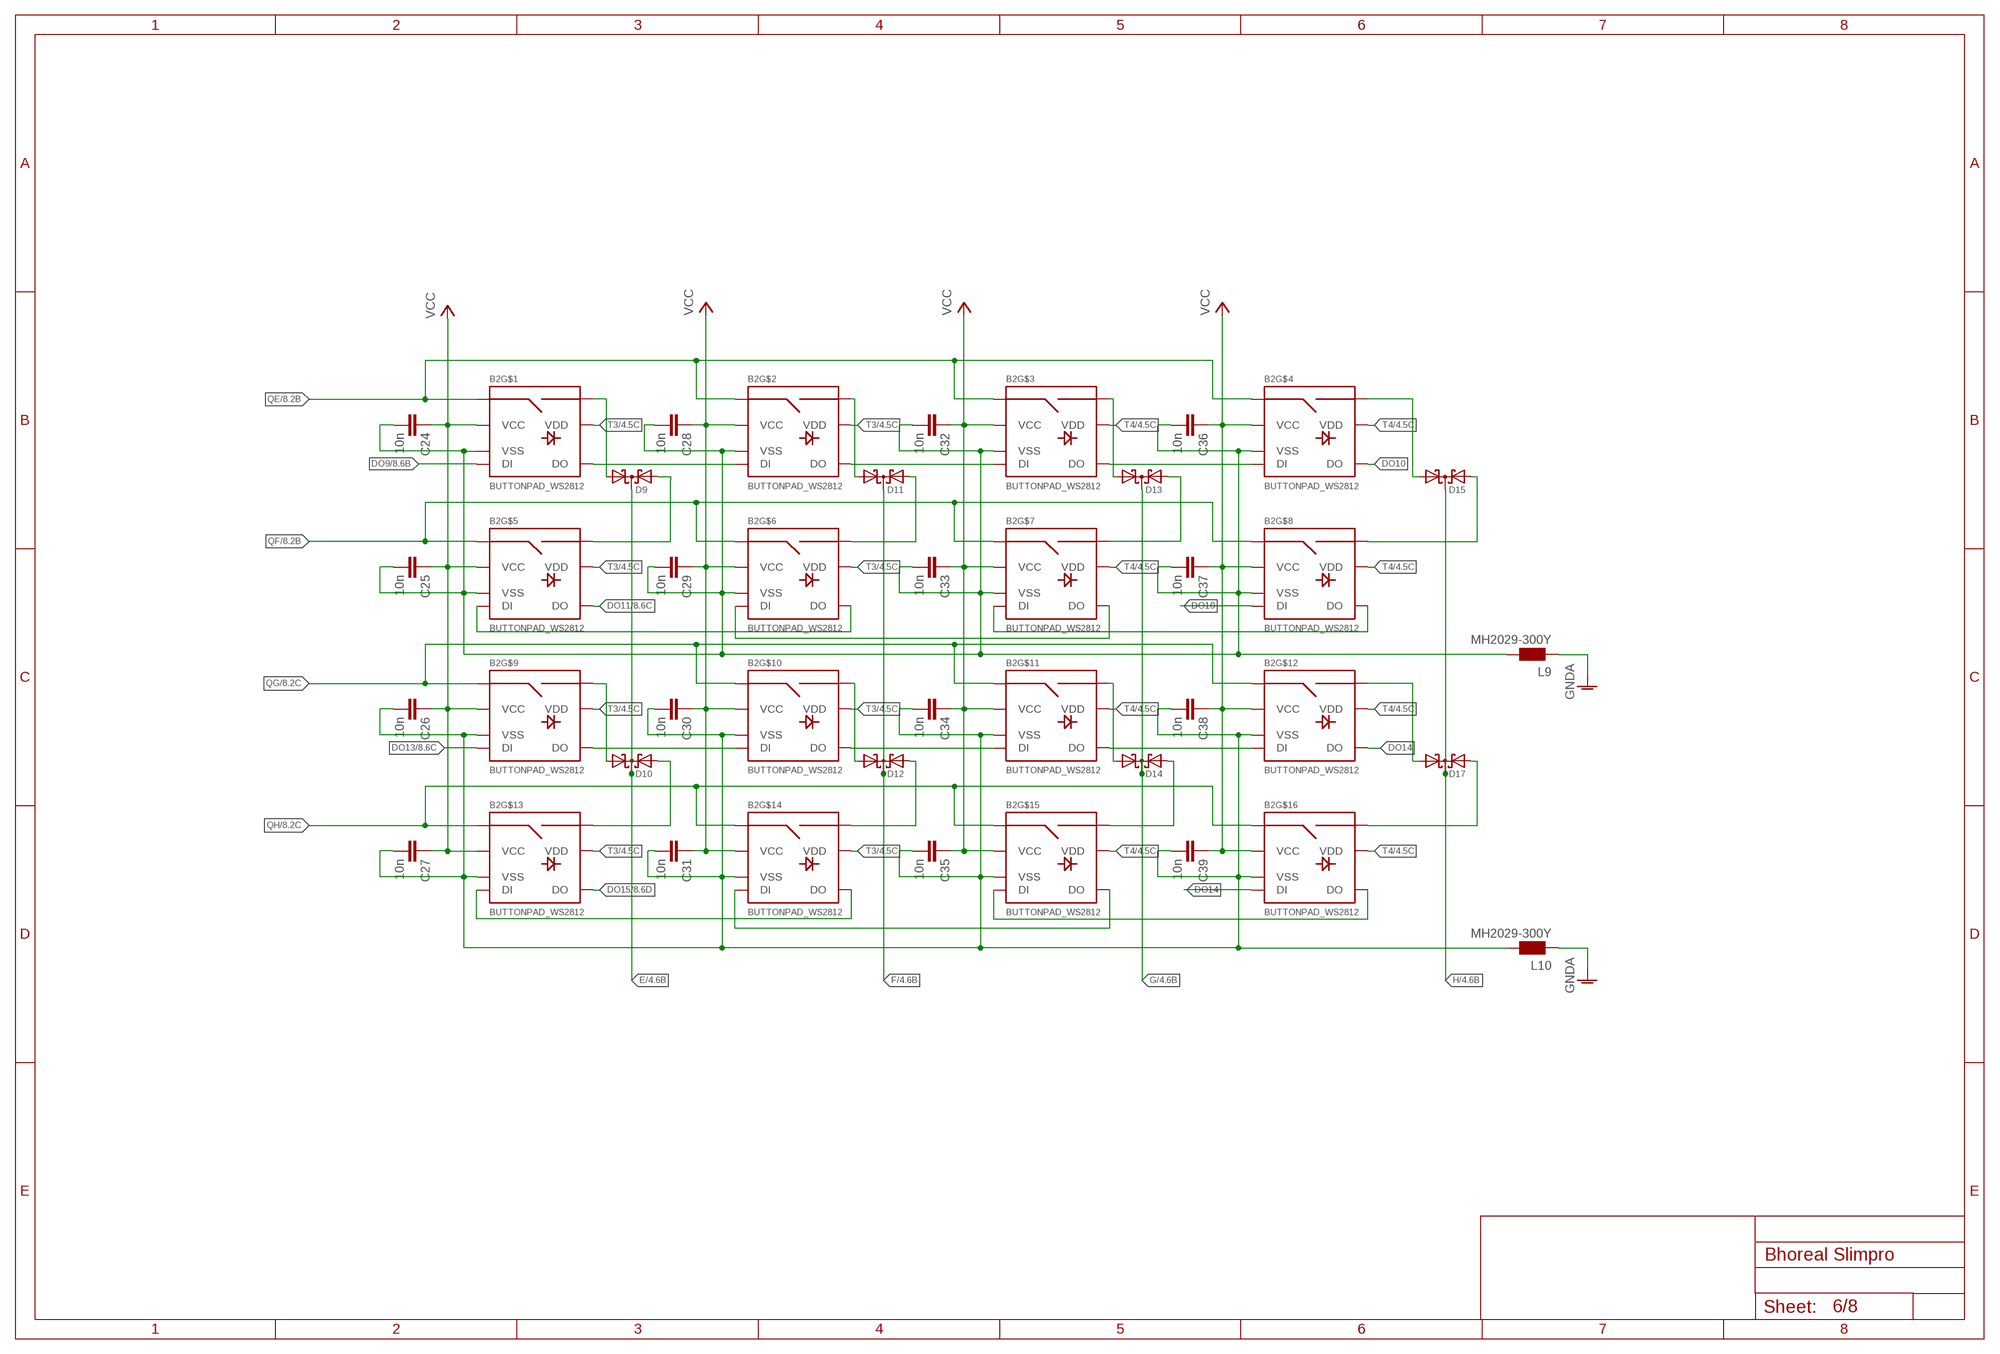
[diagram p5: schematic, sheet 6]

### Parts
B2  BUTTONPAD_WS2812  [BUTTONPAD_WS2812]
C24  10n  C-EUC0603  [C0603]
C25  10n  C-EUC0603  [C0603]
C26  10n  C-EUC0603  [C0603]
C27  10n  C-EUC0603  [C0603]
C28  10n  C-EUC0603  [C0603]
C29  10n  C-EUC0603  [C0603]
C30  10n  C-EUC0603  [C0603]
C31  10n  C-EUC0603  [C0603]
C32  10n  C-EUC0603  [C0603]
C33  10n  C-EUC0603  [C0603]
C34  10n  C-EUC0603  [C0603]
C35  10n  C-EUC0603  [C0603]
C36  10n  C-EUC0603  [C0603]
C37  10n  C-EUC0603  [C0603]
C38  10n  C-EUC0603  [C0603]
C39  10n  C-EUC0603  [C0603]
D9  BAV70LT3G  BAS70-05  [SOT23]
D10  BAV70LT3G  BAS70-05  [SOT23]
D11  BAV70LT3G  BAS70-05  [SOT23]
D12  BAV70LT3G  BAS70-05  [SOT23]
D13  BAV70LT3G  BAS70-05  [SOT23]
D14  BAV70LT3G  BAS70-05  [SOT23]
D15  BAV70LT3G  BAS70-05  [SOT23]
D17  BAV70LT3G  BAS70-05  [SOT23]
L9  MH2029-300Y  WE-CBF_0805  [0805]
L10  MH2029-300Y  WE-CBF_0805  [0805]

### Nets
DO9: B2.2A(DI) ; also sheet 8
DO10: B2.1D(DO) B2.2H(DI)
DO11: B2.1E(DO) ; also sheet 8
DO13: B2.2I(DI) ; also sheet 8
DO14: B2.1L(DO) B2.2P(DI)
DO15: B2.1M(DO) ; also sheet 8
E: D9.3(C) D10.3(C) ; also sheet 4,5
F: D11.3(C) D12.3(C) ; also sheet 4,5
G: D13.3(C) D14.3(C) ; also sheet 4,5
GNDA [power]: L9.1 L10.1 ; also sheet 1,2,5,7,8
H: D15.3(C) D17.3(C) ; also sheet 4,5
N$32: B2.1A(DO) B2.2B(DI)
N$34: B2.1B(DO) B2.2C(DI)
N$35: B2.1C(DO) B2.2D(DI)
N$36: B2.1K(DO) B2.2L(DI)
N$37: B2.1J(DO) B2.2K(DI)
N$38: B2.1I(DO) B2.2J(DI)
N$39: B2.1F(DO) B2.2E(DI)
N$40: B2.1G(DO) B2.2F(DI)
N$41: B2.1H(DO) B2.2G(DI)
N$42: B2.1P(DO) B2.2O(DI)
N$43: B2.1O(DO) B2.2N(DI)
N$44: B2.1N(DO) B2.2M(DI)
N$45: B2.SIG2A(SIG2) D9.1(A1)
N$46: B2.SIG2E(SIG2) D9.2(A2)
N$47: B2.SIG2I(SIG2) D10.1(A1)
N$48: B2.SIG2M(SIG2) D10.2(A2)
N$49: B2.SIG2B(SIG2) D11.1(A1)
N$50: B2.SIG2F(SIG2) D11.2(A2)
N$51: B2.SIG2J(SIG2) D12.1(A1)
N$52: B2.SIG2N(SIG2) D12.2(A2)
N$53: B2.SIG2C(SIG2) D13.1(A1)
N$54: B2.SIG2G(SIG2) D13.2(A2)
N$55: B2.SIG2K(SIG2) D14.1(A1)
N$56: B2.SIG2O(SIG2) D14.2(A2)
N$57: B2.SIG2L(SIG2) D17.1(A1)
N$58: B2.SIG2P(SIG2) D17.2(A2)
N$59: B2.SIG2D(SIG2) D15.1(A1)
N$60: B2.SIG2H(SIG2) D15.2(A2)
N$149 [power_led]: B2.6I(VSS) B2.6J(VSS) B2.6K(VSS) B2.6L(VSS) B2.6M(VSS) B2.6N(VSS) B2.6O(VSS) B2.6P(VSS) C26.2 C27.2 C30.2 C31.2 C34.2 C35.2 C38.2 C39.2 L10.2
N$153 [power_led]: B2.6A(VSS) B2.6B(VSS) B2.6C(VSS) B2.6D(VSS) B2.6E(VSS) B2.6F(VSS) B2.6G(VSS) B2.6H(VSS) C24.2 C25.2 C28.2 C29.2 C32.2 C33.2 C36.2 C37.2 L9.2
QE: B2.SIG1A(SIG1) B2.SIG1B(SIG1) B2.SIG1C(SIG1) B2.SIG1D(SIG1) ; also sheet 4,8
QF: B2.SIG1E(SIG1) B2.SIG1F(SIG1) B2.SIG1G(SIG1) B2.SIG1H(SIG1) ; also sheet 4,8
QG: B2.SIG1I(SIG1) B2.SIG1J(SIG1) B2.SIG1K(SIG1) B2.SIG1L(SIG1) ; also sheet 4,8
QH: B2.SIG1M(SIG1) B2.SIG1N(SIG1) B2.SIG1O(SIG1) B2.SIG1P(SIG1) ; also sheet 4,8
T3 [power_led]: B2.5A(VDD) B2.5B(VDD) B2.5E(VDD) B2.5F(VDD) B2.5I(VDD) B2.5J(VDD) B2.5M(VDD) B2.5N(VDD) ; also sheet 4
T4 [power_led]: B2.5C(VDD) B2.5D(VDD) B2.5G(VDD) B2.5H(VDD) B2.5K(VDD) B2.5L(VDD) B2.5O(VDD) B2.5P(VDD) ; also sheet 4
VCC: B2.3A(VCC) B2.3B(VCC) B2.3C(VCC) B2.3D(VCC) B2.3E(VCC) B2.3F(VCC) B2.3G(VCC) B2.3H(VCC) B2.3I(VCC) B2.3J(VCC) B2.3K(VCC) B2.3L(VCC) B2.3M(VCC) B2.3N(VCC) B2.3O(VCC) B2.3P(VCC) C24.1 C25.1 C26.1 C27.1 C28.1 C29.1 C30.1 C31.1 C32.1 C33.1 C34.1 C35.1 C36.1 C37.1 C38.1 C39.1 ; also sheet 1,4,5,7,8

## Sheet 7 of 8
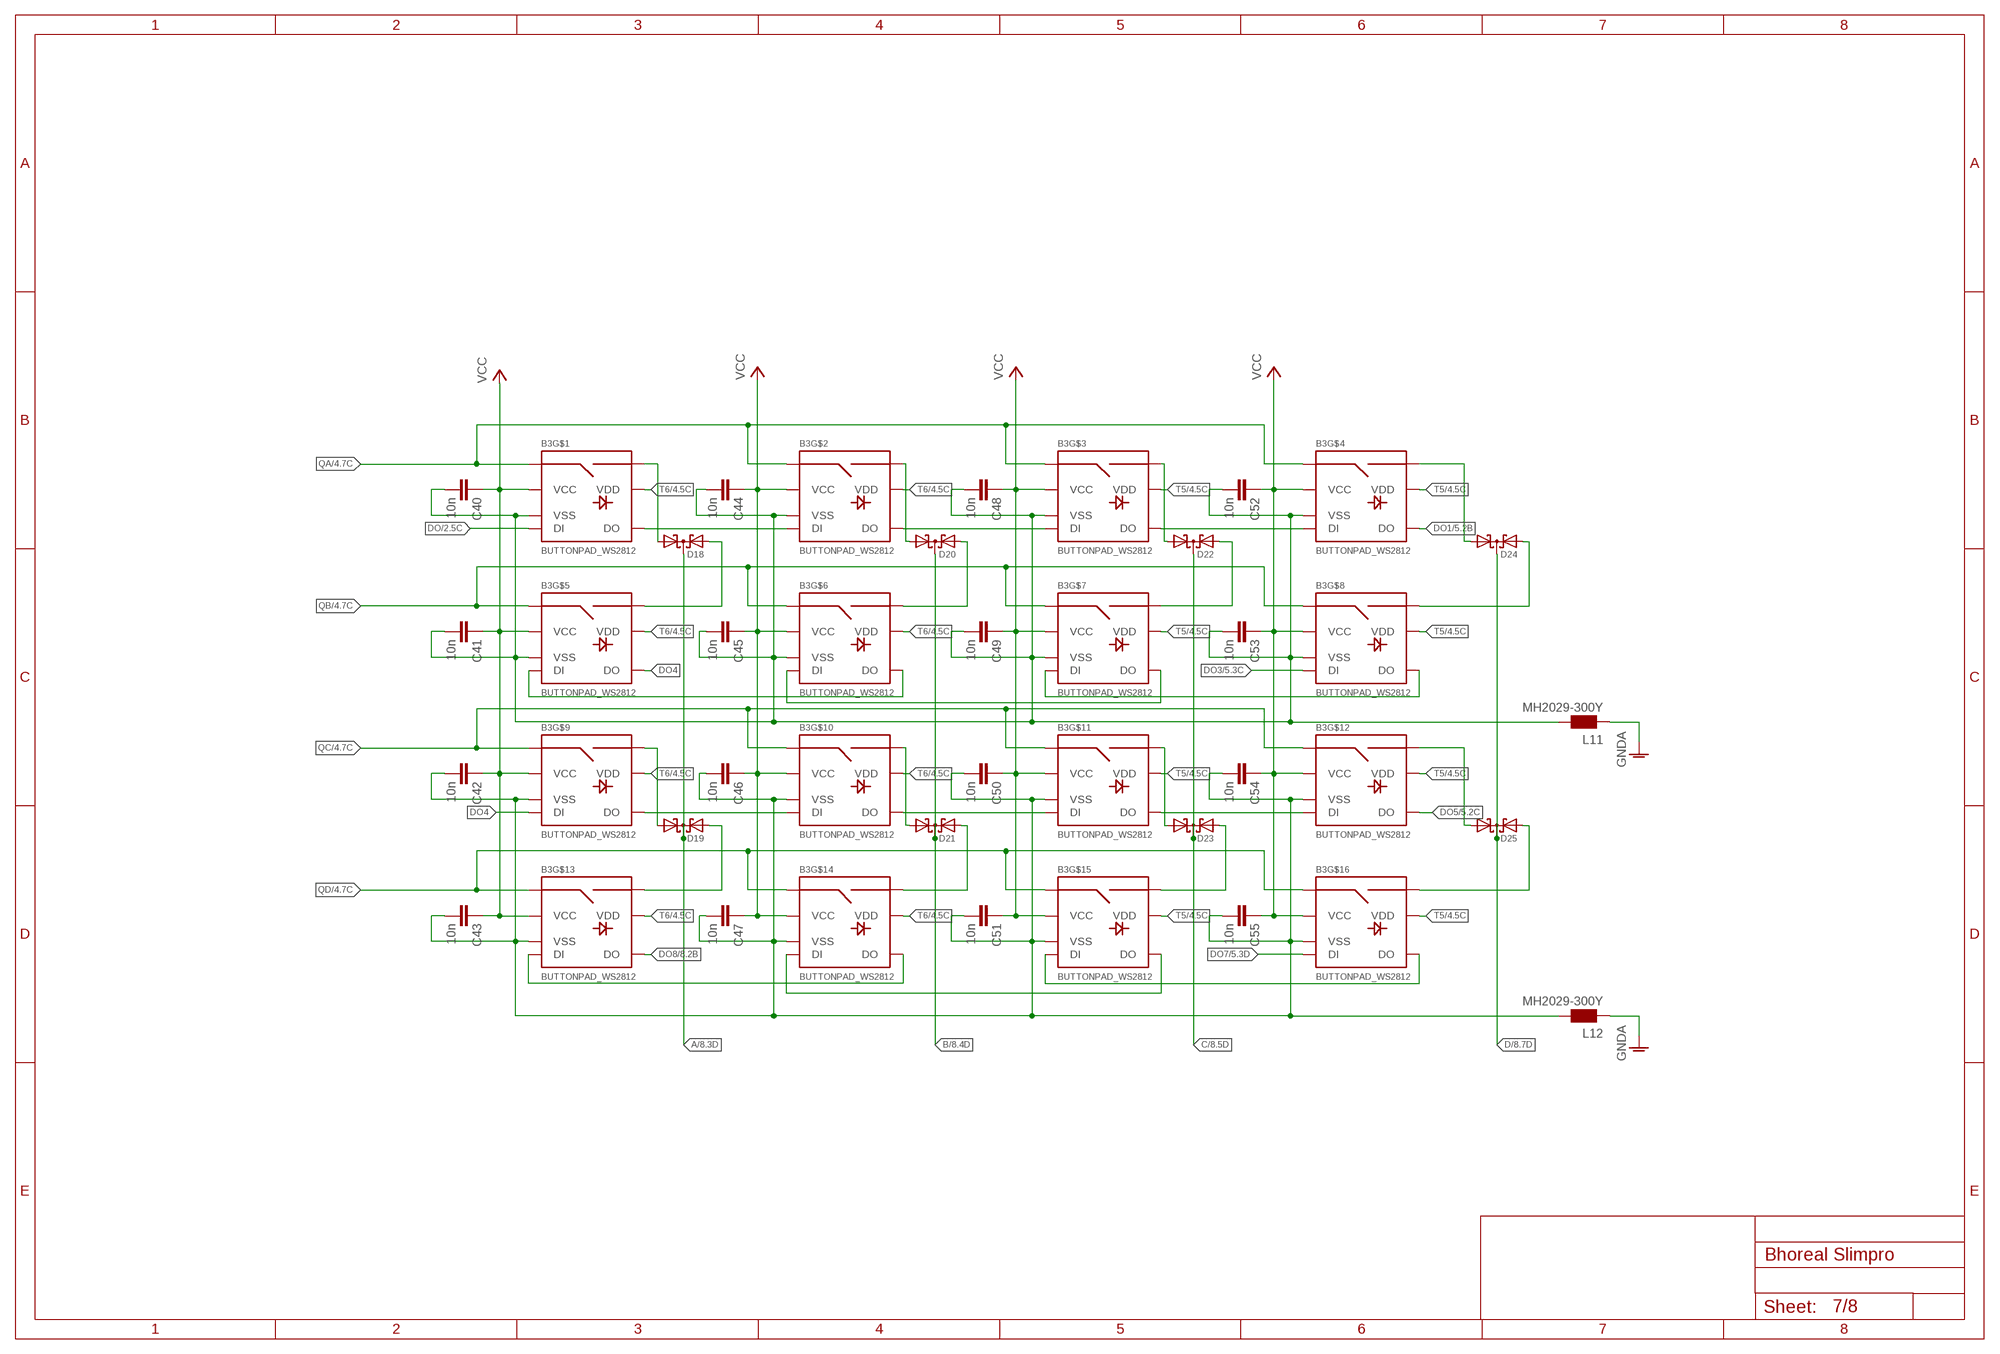
[diagram p6: schematic, sheet 7]

### Parts
B3  BUTTONPAD_WS2812  [BUTTONPAD_WS2812]
C40  10n  C-EUC0603  [C0603]
C41  10n  C-EUC0603  [C0603]
C42  10n  C-EUC0603  [C0603]
C43  10n  C-EUC0603  [C0603]
C44  10n  C-EUC0603  [C0603]
C45  10n  C-EUC0603  [C0603]
C46  10n  C-EUC0603  [C0603]
C47  10n  C-EUC0603  [C0603]
C48  10n  C-EUC0603  [C0603]
C49  10n  C-EUC0603  [C0603]
C50  10n  C-EUC0603  [C0603]
C51  10n  C-EUC0603  [C0603]
C52  10n  C-EUC0603  [C0603]
C53  10n  C-EUC0603  [C0603]
C54  10n  C-EUC0603  [C0603]
C55  10n  C-EUC0603  [C0603]
D18  BAV70LT3G  BAS70-05  [SOT23]
D19  BAV70LT3G  BAS70-05  [SOT23]
D20  BAV70LT3G  BAS70-05  [SOT23]
D21  BAV70LT3G  BAS70-05  [SOT23]
D22  BAV70LT3G  BAS70-05  [SOT23]
D23  BAV70LT3G  BAS70-05  [SOT23]
D24  BAV70LT3G  BAS70-05  [SOT23]
D25  BAV70LT3G  BAS70-05  [SOT23]
L11  MH2029-300Y  WE-CBF_0805  [0805]
L12  MH2029-300Y  WE-CBF_0805  [0805]

### Nets
A: D18.3(C) D19.3(C) ; also sheet 4,8
B: D20.3(C) D21.3(C) ; also sheet 4,8
C: D22.3(C) D23.3(C) ; also sheet 4,8
D: D24.3(C) D25.3(C) ; also sheet 4,8
DO: B3.2A(DI) ; also sheet 2
DO1: B3.1D(DO) ; also sheet 5
DO3: B3.2H(DI) ; also sheet 5
DO4: B3.1E(DO) B3.2I(DI)
DO5: B3.1L(DO) ; also sheet 5
DO7: B3.2P(DI) ; also sheet 5
DO8: B3.1M(DO) ; also sheet 8
GNDA [power]: L11.1 L12.1 ; also sheet 1,2,5,6,8
N$33: B3.1A(DO) B3.2B(DI)
N$62: B3.1B(DO) B3.2C(DI)
N$63: B3.1C(DO) B3.2D(DI)
N$64: B3.1K(DO) B3.2L(DI)
N$65: B3.1J(DO) B3.2K(DI)
N$66: B3.1I(DO) B3.2J(DI)
N$67: B3.1F(DO) B3.2E(DI)
N$68: B3.1G(DO) B3.2F(DI)
N$69: B3.1H(DO) B3.2G(DI)
N$70: B3.1P(DO) B3.2O(DI)
N$71: B3.1O(DO) B3.2N(DI)
N$72: B3.1N(DO) B3.2M(DI)
N$73: B3.SIG2A(SIG2) D18.1(A1)
N$74: B3.SIG2E(SIG2) D18.2(A2)
N$75: B3.SIG2I(SIG2) D19.1(A1)
N$76: B3.SIG2M(SIG2) D19.2(A2)
N$77: B3.SIG2B(SIG2) D20.1(A1)
N$78: B3.SIG2F(SIG2) D20.2(A2)
N$79: B3.SIG2J(SIG2) D21.1(A1)
N$80: B3.SIG2N(SIG2) D21.2(A2)
N$81: B3.SIG2C(SIG2) D22.1(A1)
N$82: B3.SIG2G(SIG2) D22.2(A2)
N$83: B3.SIG2K(SIG2) D23.1(A1)
N$84: B3.SIG2O(SIG2) D23.2(A2)
N$85: B3.SIG2L(SIG2) D25.1(A1)
N$86: B3.SIG2P(SIG2) D25.2(A2)
N$87: B3.SIG2D(SIG2) D24.1(A1)
N$88: B3.SIG2H(SIG2) D24.2(A2)
N$150 [power_led]: B3.6A(VSS) B3.6B(VSS) B3.6C(VSS) B3.6D(VSS) B3.6E(VSS) B3.6F(VSS) B3.6G(VSS) B3.6H(VSS) C40.2 C41.2 C44.2 C45.2 C48.2 C49.2 C52.2 C53.2 L11.2
N$157 [power_led]: B3.6I(VSS) B3.6J(VSS) B3.6K(VSS) B3.6L(VSS) B3.6M(VSS) B3.6N(VSS) B3.6O(VSS) B3.6P(VSS) C42.2 C43.2 C46.2 C47.2 C50.2 C51.2 C54.2 C55.2 L12.2
QA: B3.SIG1A(SIG1) B3.SIG1B(SIG1) B3.SIG1C(SIG1) B3.SIG1D(SIG1) ; also sheet 4,5
QB: B3.SIG1E(SIG1) B3.SIG1F(SIG1) B3.SIG1G(SIG1) B3.SIG1H(SIG1) ; also sheet 4,5
QC: B3.SIG1I(SIG1) B3.SIG1J(SIG1) B3.SIG1K(SIG1) B3.SIG1L(SIG1) ; also sheet 4,5
QD: B3.SIG1M(SIG1) B3.SIG1N(SIG1) B3.SIG1O(SIG1) B3.SIG1P(SIG1) ; also sheet 4,5
T5 [power_led]: B3.5C(VDD) B3.5D(VDD) B3.5G(VDD) B3.5H(VDD) B3.5K(VDD) B3.5L(VDD) B3.5O(VDD) B3.5P(VDD) ; also sheet 4
T6 [power_led]: B3.5A(VDD) B3.5B(VDD) B3.5E(VDD) B3.5F(VDD) B3.5I(VDD) B3.5J(VDD) B3.5M(VDD) B3.5N(VDD) ; also sheet 4
VCC: B3.3A(VCC) B3.3B(VCC) B3.3C(VCC) B3.3D(VCC) B3.3E(VCC) B3.3F(VCC) B3.3G(VCC) B3.3H(VCC) B3.3I(VCC) B3.3J(VCC) B3.3K(VCC) B3.3L(VCC) B3.3M(VCC) B3.3N(VCC) B3.3O(VCC) B3.3P(VCC) C40.1 C41.1 C42.1 C43.1 C44.1 C45.1 C46.1 C47.1 C48.1 C49.1 C50.1 C51.1 C52.1 C53.1 C54.1 C55.1 ; also sheet 1,4,5,6,8

## Sheet 8 of 8
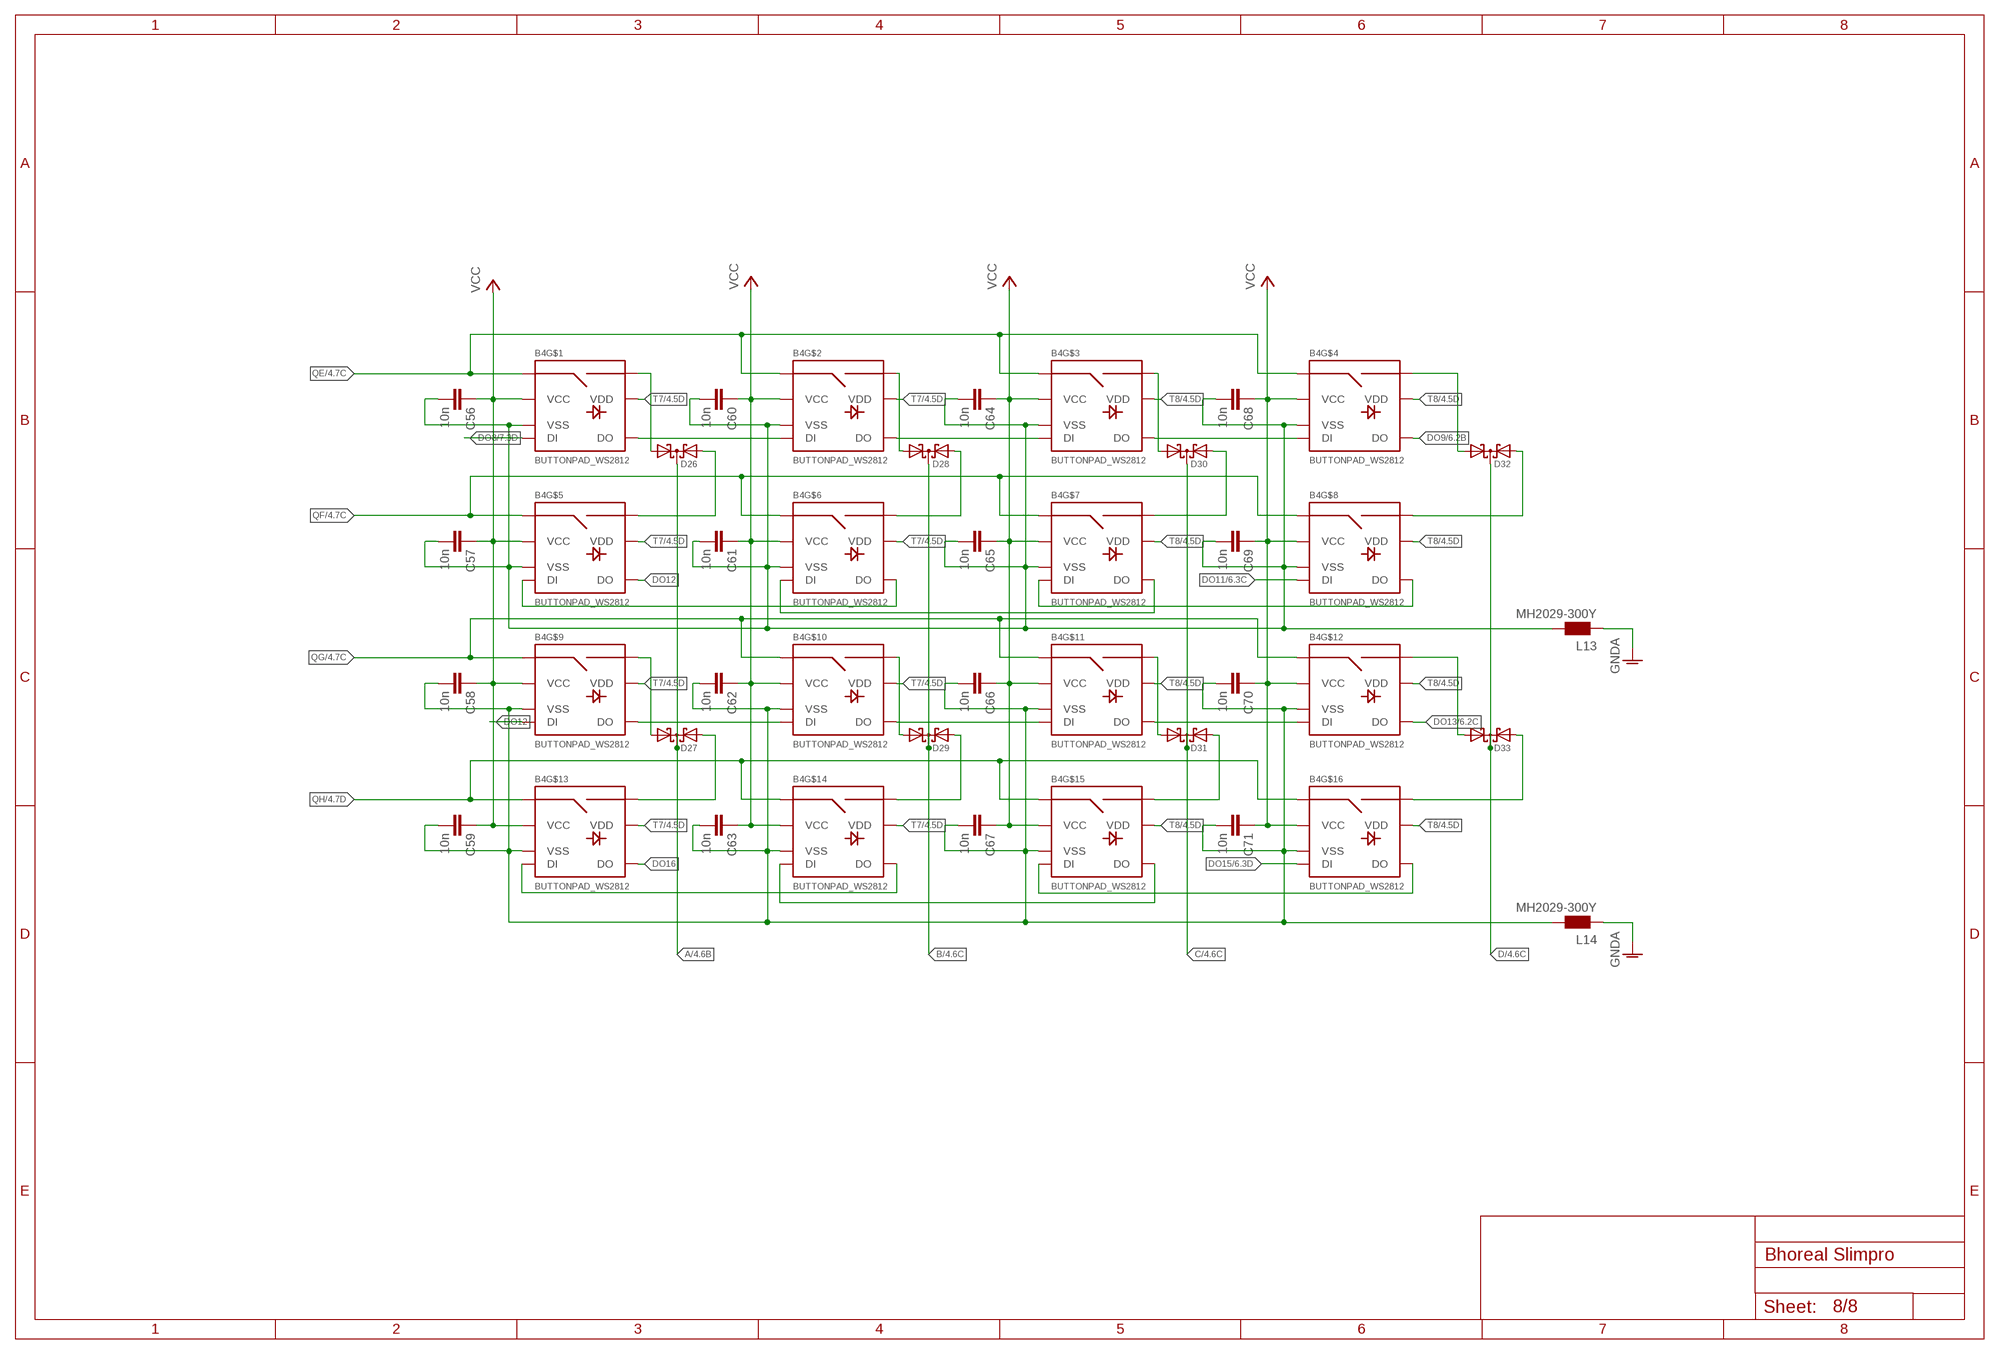
[diagram p7: schematic, sheet 8]

### Parts
B4  BUTTONPAD_WS2812  [BUTTONPAD_WS2812]
C56  10n  C-EUC0603  [C0603]
C57  10n  C-EUC0603  [C0603]
C58  10n  C-EUC0603  [C0603]
C59  10n  C-EUC0603  [C0603]
C60  10n  C-EUC0603  [C0603]
C61  10n  C-EUC0603  [C0603]
C62  10n  C-EUC0603  [C0603]
C63  10n  C-EUC0603  [C0603]
C64  10n  C-EUC0603  [C0603]
C65  10n  C-EUC0603  [C0603]
C66  10n  C-EUC0603  [C0603]
C67  10n  C-EUC0603  [C0603]
C68  10n  C-EUC0603  [C0603]
C69  10n  C-EUC0603  [C0603]
C70  10n  C-EUC0603  [C0603]
C71  10n  C-EUC0603  [C0603]
D26  BAV70LT3G  BAS70-05  [SOT23]
D27  BAV70LT3G  BAS70-05  [SOT23]
D28  BAV70LT3G  BAS70-05  [SOT23]
D29  BAV70LT3G  BAS70-05  [SOT23]
D30  BAV70LT3G  BAS70-05  [SOT23]
D31  BAV70LT3G  BAS70-05  [SOT23]
D32  BAV70LT3G  BAS70-05  [SOT23]
D33  BAV70LT3G  BAS70-05  [SOT23]
L13  MH2029-300Y  WE-CBF_0805  [0805]
L14  MH2029-300Y  WE-CBF_0805  [0805]

### Nets
A: D26.3(C) D27.3(C) ; also sheet 4,7
B: D28.3(C) D29.3(C) ; also sheet 4,7
C: D30.3(C) D31.3(C) ; also sheet 4,7
D: D32.3(C) D33.3(C) ; also sheet 4,7
DO8: B4.2A(DI) ; also sheet 7
DO9: B4.1D(DO) ; also sheet 6
DO11: B4.2H(DI) ; also sheet 6
DO12: B4.1E(DO) B4.2I(DI)
DO13: B4.1L(DO) ; also sheet 6
DO15: B4.2P(DI) ; also sheet 6
DO16: B4.1M(DO)
GNDA [power]: L13.1 L14.1 ; also sheet 1,2,5,6,7
N$89: B4.1A(DO) B4.2B(DI)
N$90: B4.1B(DO) B4.2C(DI)
N$91: B4.1C(DO) B4.2D(DI)
N$92: B4.1K(DO) B4.2L(DI)
N$93: B4.1J(DO) B4.2K(DI)
N$94: B4.1I(DO) B4.2J(DI)
N$95: B4.1F(DO) B4.2E(DI)
N$96: B4.1G(DO) B4.2F(DI)
N$97: B4.1H(DO) B4.2G(DI)
N$98: B4.1P(DO) B4.2O(DI)
N$99: B4.1O(DO) B4.2N(DI)
N$100: B4.1N(DO) B4.2M(DI)
N$101: B4.SIG2A(SIG2) D26.1(A1)
N$102: B4.SIG2E(SIG2) D26.2(A2)
N$103: B4.SIG2I(SIG2) D27.1(A1)
N$104: B4.SIG2M(SIG2) D27.2(A2)
N$105: B4.SIG2B(SIG2) D28.1(A1)
N$106: B4.SIG2F(SIG2) D28.2(A2)
N$107: B4.SIG2J(SIG2) D29.1(A1)
N$108: B4.SIG2N(SIG2) D29.2(A2)
N$109: B4.SIG2C(SIG2) D30.1(A1)
N$110: B4.SIG2G(SIG2) D30.2(A2)
N$111: B4.SIG2K(SIG2) D31.1(A1)
N$112: B4.SIG2O(SIG2) D31.2(A2)
N$113: B4.SIG2L(SIG2) D33.1(A1)
N$114: B4.SIG2P(SIG2) D33.2(A2)
N$115: B4.SIG2D(SIG2) D32.1(A1)
N$116: B4.SIG2H(SIG2) D32.2(A2)
N$151 [power_led]: B4.6I(VSS) B4.6J(VSS) B4.6K(VSS) B4.6L(VSS) B4.6M(VSS) B4.6N(VSS) B4.6O(VSS) B4.6P(VSS) C58.2 C59.2 C62.2 C63.2 C66.2 C67.2 C70.2 C71.2 L14.2
N$154 [power_led]: B4.6A(VSS) B4.6B(VSS) B4.6C(VSS) B4.6D(VSS) B4.6E(VSS) B4.6F(VSS) B4.6G(VSS) B4.6H(VSS) C56.2 C57.2 C60.2 C61.2 C64.2 C65.2 C68.2 C69.2 L13.2
QE: B4.SIG1A(SIG1) B4.SIG1B(SIG1) B4.SIG1C(SIG1) B4.SIG1D(SIG1) ; also sheet 4,6
QF: B4.SIG1E(SIG1) B4.SIG1F(SIG1) B4.SIG1G(SIG1) B4.SIG1H(SIG1) ; also sheet 4,6
QG: B4.SIG1I(SIG1) B4.SIG1J(SIG1) B4.SIG1K(SIG1) B4.SIG1L(SIG1) ; also sheet 4,6
QH: B4.SIG1M(SIG1) B4.SIG1N(SIG1) B4.SIG1O(SIG1) B4.SIG1P(SIG1) ; also sheet 4,6
T7 [power_led]: B4.5A(VDD) B4.5B(VDD) B4.5E(VDD) B4.5F(VDD) B4.5I(VDD) B4.5J(VDD) B4.5M(VDD) B4.5N(VDD) ; also sheet 4
T8 [power_led]: B4.5C(VDD) B4.5D(VDD) B4.5G(VDD) B4.5H(VDD) B4.5K(VDD) B4.5L(VDD) B4.5O(VDD) B4.5P(VDD) ; also sheet 4
VCC: B4.3A(VCC) B4.3B(VCC) B4.3C(VCC) B4.3D(VCC) B4.3E(VCC) B4.3F(VCC) B4.3G(VCC) B4.3H(VCC) B4.3I(VCC) B4.3J(VCC) B4.3K(VCC) B4.3L(VCC) B4.3M(VCC) B4.3N(VCC) B4.3O(VCC) B4.3P(VCC) C56.1 C57.1 C58.1 C59.1 C60.1 C61.1 C62.1 C63.1 C64.1 C65.1 C66.1 C67.1 C68.1 C69.1 C70.1 C71.1 ; also sheet 1,4,5,6,7

## Library data of the parts
ASSOC. CONNEC. LOW_BAT RX_USB TX_USB = led:LED: LED OSRAM: - CHIPLED LG R971, LG N971, LY N971, LG Q971, LY Q971, LO R971, LY R971 LH N974, LH R974 LS Q976, LO Q976, LY Q976 LO Q996 - Hyper CHIPLED LW Q18S LB Q993, LB Q99A, LB R99A - SideLED LS A670, LO A670, LY A670, LG A670, LP A670 LB A673, LV A673, LT A673, LW A673 LH A674 LY A675 LS A676, LA A676, LO A676, LY A676, LW A676 LS A679, LY A679, LG A679 - Hyper Micro SIDELED® LS Y876, LA Y876, LO Y876, LY Y876 LT Y87S - SmartLED LW L88C, LW L88S LB L89C, LB L89S, LG L890 LS L89K, LO L89K, LY L89K LS L896, LA L896, LO L896, LY L896 - TOPLED LS T670, LO T670, LY T670, LG T670, LP T670 LSG T670, LSP T670, LSY T670, LOP T670, LYG T670 LG T671, LOG T671, LSG T671 LB T673, LV T673, LT T673, LW T673 LH T674 LS T676, LA T676, LO T676, LY T676, LB T676, LH T676, LSB T676, LW T676 LB T67C, LV T67C, LT T67C, LS T67K, LO T67K, LY T67K, LW E67C LS E67B, LA E67B, LO E67B, LY E67B, LB E67C, LV E67C, LT E67C LW T67C LS T679, LY T679, LG T679 LS T770, LO T770, LY T770, LG T770, LP T770 LB T773, LV T773, LT T773, LW T773 LH T774 LS E675, LA E675, LY E675, LS T675 LS T776, LA T776, LO T776, LY T776, LB T776 LHGB T686 LT T68C, LB T68C - Hyper Mini TOPLED® LB M676 - Mini TOPLED Santana® LG M470 LS M47K, LO M47K, LY M47K Source: http://www.osram.convergy.de LUXEON: - LUMILED® LXK2-PW12-R00, LXK2-PW12-S00, LXK2-PW14-U00, LXK2-PW14-V00 LXK2-PM12-R00, LXK2-PM12-S00, LXK2-PM14-U00 LXK2-PE12-Q00, LXK2-PE12-R00, LXK2-PE12-S00, LXK2-PE14-T00, LXK2-PE14-U00 LXK2-PB12-K00, LXK2-PB12-L00, LXK2-PB12-M00, LXK2-PB14-N00, LXK2-PB14-P00, LXK2-PB14-Q00 LXK2-PR12-L00, LXK2-PR12-M00, LXK2-PR14-Q00, LXK2-PR14-R00 LXK2-PD12-Q00, LXK2-PD12-R00, LXK2-PD12-S00 LXK2-PH12-R00, LXK2-PH12-S00 LXK2-PL12-P00, LXK2-PL12-Q00, LXK2-PL12-R00 Source: www.luxeon.com KINGBRIGHT: KA-3528ASYC Source: www.kingbright.com
B1-B4 = Hangar:BUTTONPAD_WS2812
BAT = SparkFun:M02: Header 2 Standard 2-pin 0.1" header. Use with straight break away headers (SKU : PRT-00116), right angle break away headers (PRT-00553), swiss pins (PRT-00743), machine pins (PRT-00117), and female headers (PRT-00115). Molex polarized connector foot print use with SKU : PRT-08233 with associated crimp pins and housings.
C1-C4 C8-C82 C85-C95 = rcl:C-EU: CAPACITOR, European symbol
C5-C7 = SmartPrj:C-EU: CAPACITOR, European symbol
C83 C84 = rcl:CPOL-EU: POLARIZED CAPACITOR, European symbol
D1-D15 D17-D33 = diode:BAS70-05: Silicon Schottky Diodes General-purpose diode for high-speed switching
D16 D36-D38 D40-D42 = diode:DIODE-: DIODE
D34 D35 D39 = diode:SCHOTTKY-DIODE: Schottky Diode
F1 = rcl:L-EU: INDUCTOR, European symbol
ICSP = SmartPrj:PINHD-2X3: PIN HEADER
ICSP1 = pinhead:PINHD-2X3: PIN HEADER
L1 = Hangar:L
L2 = SparkFun-Passives:INDUCTOR: Inductors Basic Inductor/Choke - 0603 and 1206. Footprints are not proven and vary greatly between part numbers. SRN6045- 33uH, 20% 1.4A
L3-L16 = wuerth-elektronik:WE-CBF: SMD EMI Suppression Ferrite Beads - excellent anti-EMI properties - low DCR - impedances till 3000 ohms - rated current up to 6 A
Q1-Q3 = SparkFun-DiscreteSemi:MOSFET-NCHANNEL: Common NMOSFET Parts MFG P/N Store ID Prod ID FDD8780 TRANS-09984 SI7820DN TRANS-11055 FDS6630A IC-08089 2N7002PW TRANS-11151 FQP30N06L COM-10213 TRANS-10060 BSS123LT1G TRANS-08345 BSS138 TRANS-00830 BS170 2N7000; PROD_ID: TRANS-08345
Q4-Q9 = zetex:PMOS2: DUAL 30V P-CHANNEL ENHANCEMENT MODE MOSFET Source: Data sheet <http://www.diodes.com/datasheets/ZXMP3A16DN8.pdf> SOP8 Source: Data sheet <http://www.diodes.com/datasheets/ZXMD63P03X.pdf> MSOP8; OC_FARNELL: unknown; OC_NEWARK: unknown
R1-R42 = rcl:R-EU_: RESISTOR, European symbol
RST S1 = Hangar:SWITCH-MOMENTARY-2
U1 = Hangar:NC7SV157
U2 = SparkFun:RN-131G: Roving Netowrks WiFLy GSX Module
U3 = Hangar:TPS63002
U4 = Hangar:LMZ2200X
U5 = Hangar:MCP73113/4
U6 = Hangar:LMR10510
U7 = Hangar:74HC4050: Hex non-inverting BUFFER
U8 = SmartPrj:ATMEGA32U4-XU
U9 = 74xx-eu:74*165: 8-bit parallel load SHIFT REGISTER
U10 = 74xx-eu:74*164: 8-bit parallel out SHIFT REGISTER
U11 = linear:LMV358?*: Dual General Purpose, Low Voltage, Rail-to-Rail Output Operational Amplifiers Source: http://www.national.com/mpf/LM/LMV321.html http://www.national.com/dt/lmv_qual.pdf
U12 = atmel:MEGA8: MICROCONTROLLER 8 Kbytes FLASH, 1 kbytes SRAM, 512 bytes EEPROM, USART, 6-channel 10 bit ADC, 2-channel 8 bit ADC Pin compatible with Atmega48, ATMega88, ATMega168 Source: avr.lbr; MPN: ATMEGA8-16AU; OC_FARNELL: 9171371; OC_NEWARK: 73M8863
U13 = SparkFunEagle-3-30-09:ADXL345
X1 = Hangar:MQ172X-4PA(55)
X2 = Hangar:MYCON2_USB-MINI-B
Y1 Y2 = SmartPrj:RESONATOR
Z1 Z2 = varistor:VARISTOR: VARISTOR

## Net classes
1 power: width 1 mm, drill 0.6 mm, clearance 0.203 mm
2 gnd: width 0.254 mm, drill 0.6 mm, clearance 0.203 mm
3 usbvcc: width 0.254 mm, drill 0.6 mm, clearance 0.203 mm
4 power_led: width 0.5 mm, drill 0.6 mm, clearance 0.203 mm